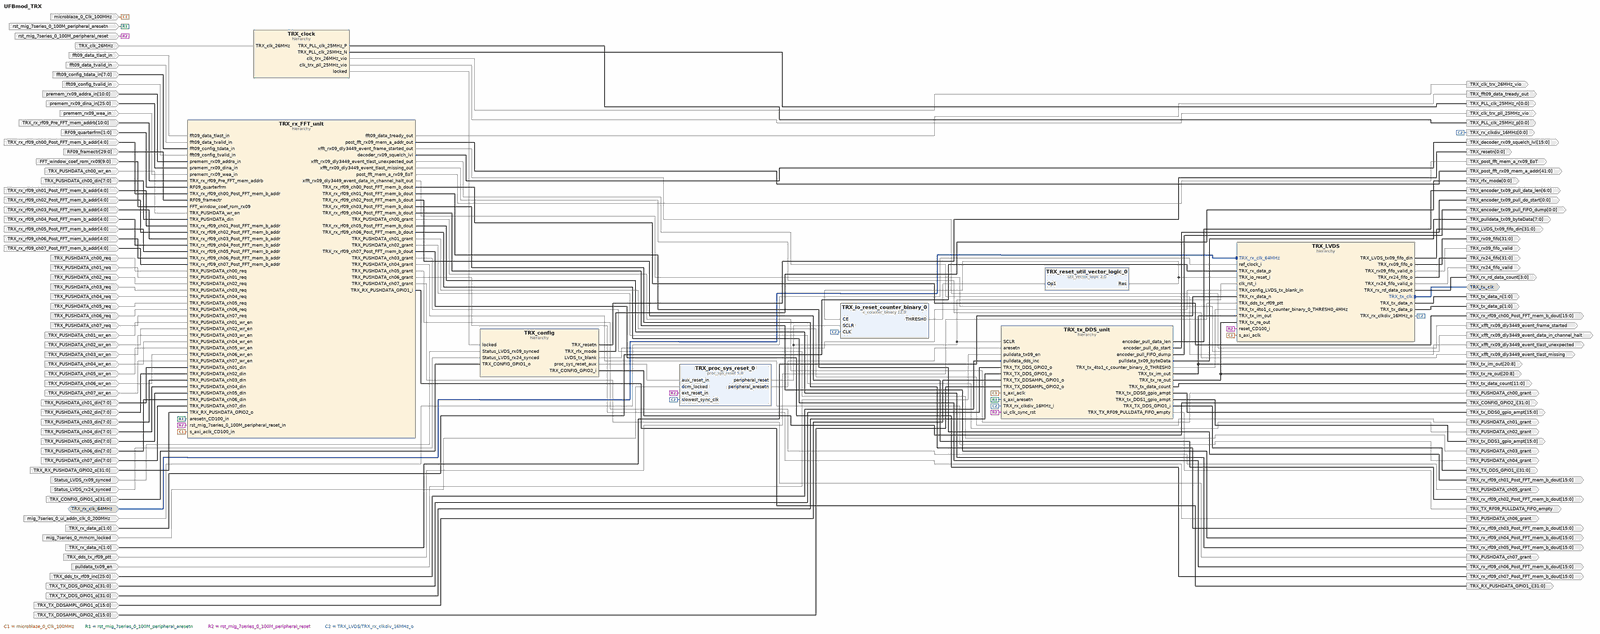
[diagram p0: block diagram of the top level, whole]
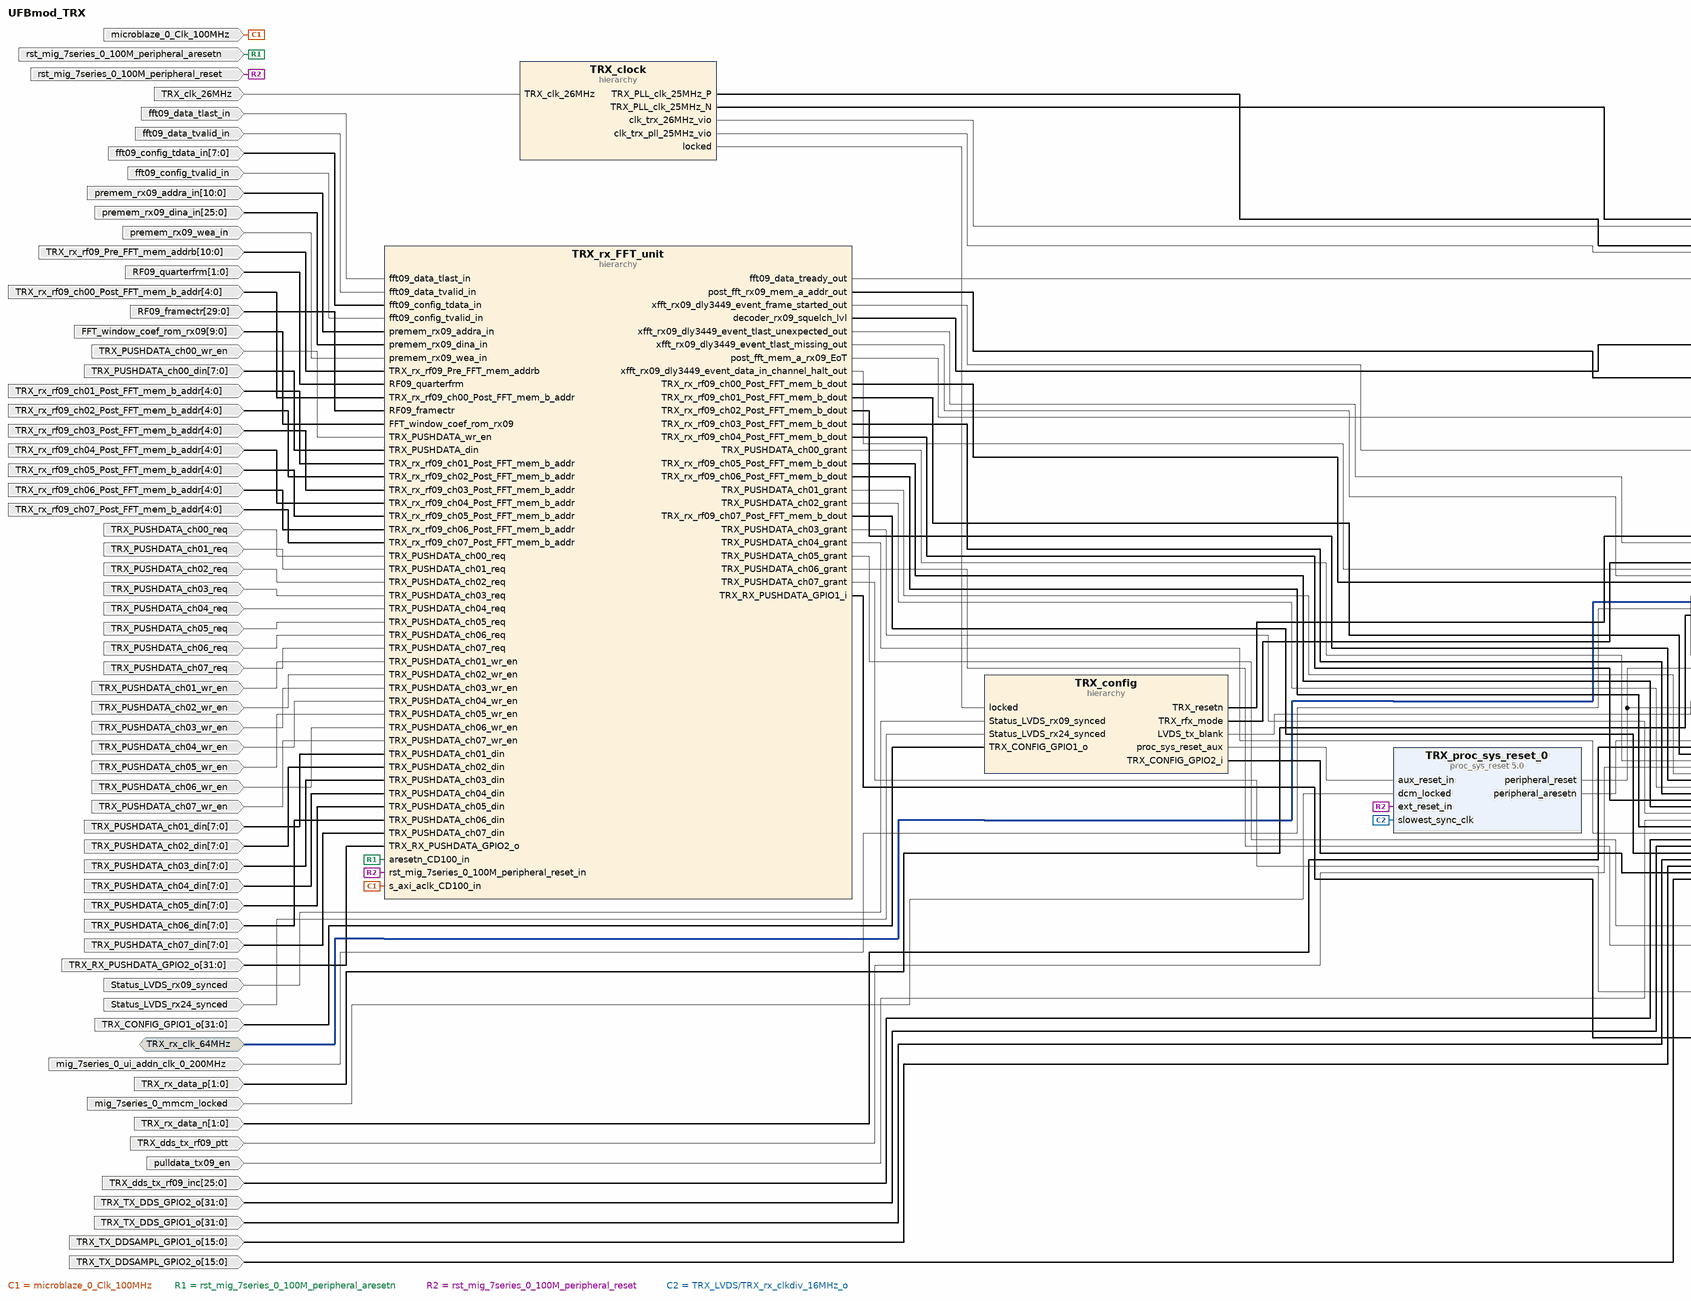
[diagram p1: block diagram of the top level, left part]
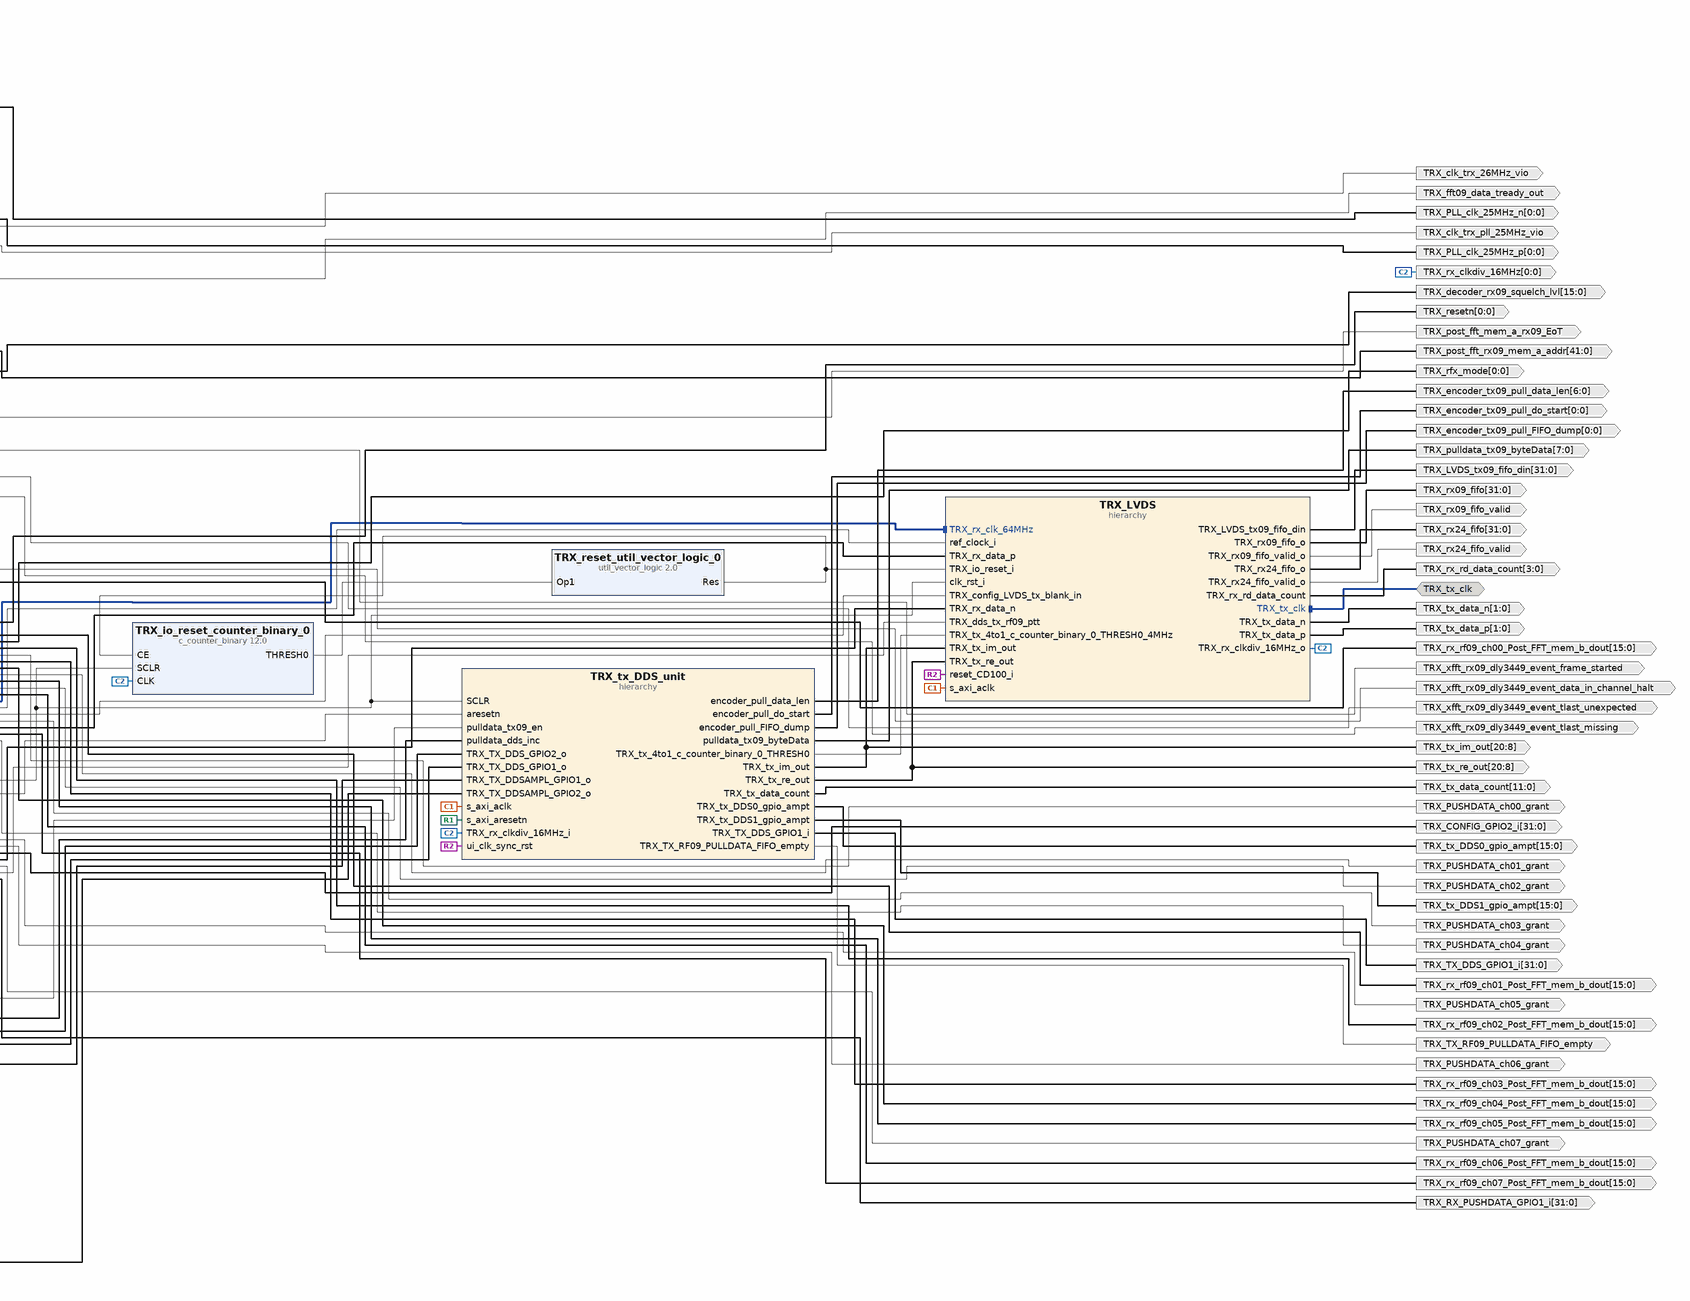
[diagram p2: block diagram of the top level, right part]
# Vivado block design UFBmod_TRX, xc7a100tfgg484-2, Vivado 2020.2
create_bd_design UFBmod_TRX

create_bd_intf_port -mode Slave -vlnv xilinx.com:interface:diff_clock_rtl:1.0 TRX_rx_clk_64MHz
set_property -dict {CONFIG.FREQ_HZ 64000000} [get_bd_intf_ports TRX_rx_clk_64MHz]
create_bd_intf_port -mode Master -vlnv xilinx.com:interface:diff_clock_rtl:1.0 TRX_tx_clk
create_bd_port -dir I -type clk microblaze_0_Clk_100MHz
set_property -dict [list \
  CONFIG.CLK_DOMAIN msys_mig_7series_0_0_ui_clk \
  CONFIG.FREQ_HZ 100000000 \
  CONFIG.PHASE 0 \
] [get_bd_ports microblaze_0_Clk_100MHz]
create_bd_port -dir I -type rst rst_mig_7series_0_100M_peripheral_aresetn
create_bd_port -dir I -type clk TRX_clk_26MHz
set_property -dict {CONFIG.CLK_DOMAIN msys_TRX_clk_26MHz CONFIG.FREQ_HZ 26000000} [get_bd_ports TRX_clk_26MHz]
create_bd_port -dir I -type clk mig_7series_0_ui_addn_clk_0_200MHz
set_property -dict {CONFIG.FREQ_HZ 200000000} [get_bd_ports mig_7series_0_ui_addn_clk_0_200MHz]
create_bd_port -dir I mig_7series_0_mmcm_locked
create_bd_port -dir I -type rst rst_mig_7series_0_100M_peripheral_reset
set_property -dict {CONFIG.POLARITY ACTIVE_HIGH} [get_bd_ports rst_mig_7series_0_100M_peripheral_reset]
create_bd_port -dir I -from 1 -to 0 TRX_rx_data_p
create_bd_port -dir I -from 1 -to 0 TRX_rx_data_n
create_bd_port -dir I fft09_data_tlast_in
create_bd_port -dir I fft09_data_tvalid_in
create_bd_port -dir I -from 7 -to 0 -type data fft09_config_tdata_in
create_bd_port -dir I fft09_config_tvalid_in
create_bd_port -dir I -from 10 -to 0 -type data premem_rx09_addra_in
create_bd_port -dir I -from 25 -to 0 -type data premem_rx09_dina_in
create_bd_port -dir I premem_rx09_wea_in
create_bd_port -dir I -from 10 -to 0 -type data TRX_rx_rf09_Pre_FFT_mem_addrb
create_bd_port -dir I -from 1 -to 0 -type data RF09_quarterfrm
create_bd_port -dir I -from 4 -to 0 -type data TRX_rx_rf09_ch00_Post_FFT_mem_b_addr
create_bd_port -dir I TRX_dds_tx_rf09_ptt
create_bd_port -dir I Status_LVDS_rx09_synced
create_bd_port -dir I Status_LVDS_rx24_synced
create_bd_port -dir I -from 29 -to 0 -type data RF09_framectr
create_bd_port -dir I -from 9 -to 0 -type data FFT_window_coef_rom_rx09
create_bd_port -dir I pulldata_tx09_en
create_bd_port -dir I -from 25 -to 0 -type data TRX_dds_tx_rf09_inc
create_bd_port -dir O -from 0 -to 0 -type rst TRX_resetn
create_bd_port -dir O -from 0 -to 0 TRX_rfx_mode
create_bd_port -dir O -from 0 -to 0 -type clk TRX_PLL_clk_25MHz_p
create_bd_port -dir O -from 0 -to 0 -type clk TRX_PLL_clk_25MHz_n
create_bd_port -dir O -from 0 -to 0 -type clk TRX_rx_clkdiv_16MHz
create_bd_port -dir O -from 1 -to 0 TRX_tx_data_p
create_bd_port -dir O -from 1 -to 0 TRX_tx_data_n
create_bd_port -dir O -from 3 -to 0 -type data TRX_rx_rd_data_count
create_bd_port -dir O -from 31 -to 0 -type data TRX_rx09_fifo
create_bd_port -dir O -from 31 -to 0 -type data TRX_rx24_fifo
create_bd_port -dir O TRX_rx09_fifo_valid
create_bd_port -dir O TRX_rx24_fifo_valid
create_bd_port -dir O TRX_fft09_data_tready_out
create_bd_port -dir O TRX_xfft_rx09_dly3449_event_frame_started
create_bd_port -dir O TRX_xfft_rx09_dly3449_event_tlast_unexpected
create_bd_port -dir O TRX_xfft_rx09_dly3449_event_tlast_missing
create_bd_port -dir O TRX_xfft_rx09_dly3449_event_data_in_channel_halt
create_bd_port -dir O -from 15 -to 0 TRX_rx_rf09_ch00_Post_FFT_mem_b_dout
create_bd_port -dir O -type clk TRX_clk_trx_26MHz_vio
create_bd_port -dir O -type clk TRX_clk_trx_pll_25MHz_vio
create_bd_port -dir O -from 20 -to 8 -type data TRX_tx_re_out
create_bd_port -dir O -from 20 -to 8 -type data TRX_tx_im_out
create_bd_port -dir O -from 41 -to 0 -type data TRX_post_fft_rx09_mem_a_addr
create_bd_port -dir O TRX_post_fft_mem_a_rx09_EoT
create_bd_port -dir O -from 6 -to 0 -type data TRX_encoder_tx09_pull_data_len
create_bd_port -dir O -from 7 -to 0 -type data TRX_pulldata_tx09_byteData
create_bd_port -dir O -from 0 -to 0 TRX_encoder_tx09_pull_do_start
create_bd_port -dir O -from 0 -to 0 TRX_encoder_tx09_pull_FIFO_dump
create_bd_port -dir O -from 11 -to 0 -type data TRX_tx_data_count
create_bd_port -dir O TRX_TX_RF09_PULLDATA_FIFO_empty
create_bd_port -dir O -from 15 -to 0 -type data TRX_decoder_rx09_squelch_lvl
create_bd_port -dir O -from 15 -to 0 -type data TRX_tx_DDS0_gpio_ampt
create_bd_port -dir O -from 15 -to 0 -type data TRX_tx_DDS1_gpio_ampt
create_bd_port -dir I TRX_PUSHDATA_ch00_wr_en
create_bd_port -dir I -from 7 -to 0 -type data TRX_PUSHDATA_ch00_din
create_bd_port -dir I -from 4 -to 0 -type data TRX_rx_rf09_ch01_Post_FFT_mem_b_addr
create_bd_port -dir I -from 4 -to 0 -type data TRX_rx_rf09_ch02_Post_FFT_mem_b_addr
create_bd_port -dir I -from 4 -to 0 -type data TRX_rx_rf09_ch03_Post_FFT_mem_b_addr
create_bd_port -dir I -from 4 -to 0 -type data TRX_rx_rf09_ch04_Post_FFT_mem_b_addr
create_bd_port -dir I -from 4 -to 0 -type data TRX_rx_rf09_ch05_Post_FFT_mem_b_addr
create_bd_port -dir I -from 4 -to 0 -type data TRX_rx_rf09_ch06_Post_FFT_mem_b_addr
create_bd_port -dir I -from 4 -to 0 -type data TRX_rx_rf09_ch07_Post_FFT_mem_b_addr
create_bd_port -dir O -from 15 -to 0 -type data TRX_rx_rf09_ch01_Post_FFT_mem_b_dout
create_bd_port -dir O -from 15 -to 0 -type data TRX_rx_rf09_ch02_Post_FFT_mem_b_dout
create_bd_port -dir O -from 15 -to 0 -type data TRX_rx_rf09_ch06_Post_FFT_mem_b_dout
create_bd_port -dir O -from 15 -to 0 -type data TRX_rx_rf09_ch07_Post_FFT_mem_b_dout
create_bd_port -dir O -from 15 -to 0 -type data TRX_rx_rf09_ch03_Post_FFT_mem_b_dout
create_bd_port -dir O -from 15 -to 0 -type data TRX_rx_rf09_ch04_Post_FFT_mem_b_dout
create_bd_port -dir O -from 15 -to 0 -type data TRX_rx_rf09_ch05_Post_FFT_mem_b_dout
create_bd_port -dir I TRX_PUSHDATA_ch01_wr_en
create_bd_port -dir I -from 7 -to 0 -type data TRX_PUSHDATA_ch01_din
create_bd_port -dir I TRX_PUSHDATA_ch00_req
create_bd_port -dir I TRX_PUSHDATA_ch01_req
create_bd_port -dir O TRX_PUSHDATA_ch00_grant
create_bd_port -dir O TRX_PUSHDATA_ch01_grant
create_bd_port -dir O TRX_PUSHDATA_ch02_grant
create_bd_port -dir O TRX_PUSHDATA_ch03_grant
create_bd_port -dir O TRX_PUSHDATA_ch04_grant
create_bd_port -dir O TRX_PUSHDATA_ch05_grant
create_bd_port -dir O TRX_PUSHDATA_ch06_grant
create_bd_port -dir O TRX_PUSHDATA_ch07_grant
create_bd_port -dir I TRX_PUSHDATA_ch02_req
create_bd_port -dir I TRX_PUSHDATA_ch03_req
create_bd_port -dir I TRX_PUSHDATA_ch04_req
create_bd_port -dir I TRX_PUSHDATA_ch05_req
create_bd_port -dir I TRX_PUSHDATA_ch06_req
create_bd_port -dir I TRX_PUSHDATA_ch07_req
create_bd_port -dir I TRX_PUSHDATA_ch02_wr_en
create_bd_port -dir I TRX_PUSHDATA_ch03_wr_en
create_bd_port -dir I TRX_PUSHDATA_ch04_wr_en
create_bd_port -dir I TRX_PUSHDATA_ch05_wr_en
create_bd_port -dir I TRX_PUSHDATA_ch06_wr_en
create_bd_port -dir I TRX_PUSHDATA_ch07_wr_en
create_bd_port -dir I -from 7 -to 0 -type data TRX_PUSHDATA_ch02_din
create_bd_port -dir I -from 7 -to 0 -type data TRX_PUSHDATA_ch03_din
create_bd_port -dir I -from 7 -to 0 -type data TRX_PUSHDATA_ch04_din
create_bd_port -dir I -from 7 -to 0 -type data TRX_PUSHDATA_ch05_din
create_bd_port -dir I -from 7 -to 0 -type data TRX_PUSHDATA_ch06_din
create_bd_port -dir I -from 7 -to 0 -type data TRX_PUSHDATA_ch07_din
create_bd_port -dir I -from 31 -to 0 TRX_CONFIG_GPIO1_o
create_bd_port -dir O -from 31 -to 0 TRX_CONFIG_GPIO2_i
create_bd_port -dir I -from 31 -to 0 TRX_TX_DDS_GPIO2_o
create_bd_port -dir O -from 31 -to 0 TRX_TX_DDS_GPIO1_i
create_bd_port -dir I -from 31 -to 0 TRX_TX_DDS_GPIO1_o
create_bd_port -dir I -from 15 -to 0 TRX_TX_DDSAMPL_GPIO1_o
create_bd_port -dir I -from 15 -to 0 TRX_TX_DDSAMPL_GPIO2_o
create_bd_port -dir I -from 31 -to 0 TRX_RX_PUSHDATA_GPIO2_o
create_bd_port -dir O -from 31 -to 0 TRX_RX_PUSHDATA_GPIO1_i
create_bd_port -dir O -from 31 -to 0 -type data TRX_LVDS_tx09_fifo_din

create_bd_cell -type ip -vlnv xilinx.com:ip:proc_sys_reset:5.0 TRX_proc_sys_reset_0
set_property -dict [list \
  CONFIG.C_AUX_RESET_HIGH 1 \
  CONFIG.RESET_BOARD_INTERFACE Custom \
  CONFIG.USE_BOARD_FLOW true \
] [get_bd_cells TRX_proc_sys_reset_0]
create_bd_cell -type ip -vlnv xilinx.com:ip:c_counter_binary:12.0 TRX_io_reset_counter_binary_0
set_property -dict [list \
  CONFIG.CE true \
  CONFIG.Count_Mode UP \
  CONFIG.Final_Count_Value 1e \
  CONFIG.Output_Width 5 \
  CONFIG.Restrict_Count true \
  CONFIG.SCLR true \
  CONFIG.Sync_Threshold_Output true \
  CONFIG.Threshold_Value 1e \
] [get_bd_cells TRX_io_reset_counter_binary_0]
create_bd_cell -type hier TRX_LVDS
create_bd_cell -type hier TRX_rx_FFT_unit
create_bd_cell -type hier TRX_config
create_bd_cell -type hier TRX_clock
create_bd_cell -type hier TRX_tx_DDS_unit
create_bd_cell -type ip -vlnv xilinx.com:ip:util_vector_logic:2.0 TRX_reset_util_vector_logic_0
set_property -dict {CONFIG.C_OPERATION not CONFIG.C_SIZE 1} [get_bd_cells TRX_reset_util_vector_logic_0]

# ---- hierarchy /TRX_LVDS ----
current_bd_instance /TRX_LVDS
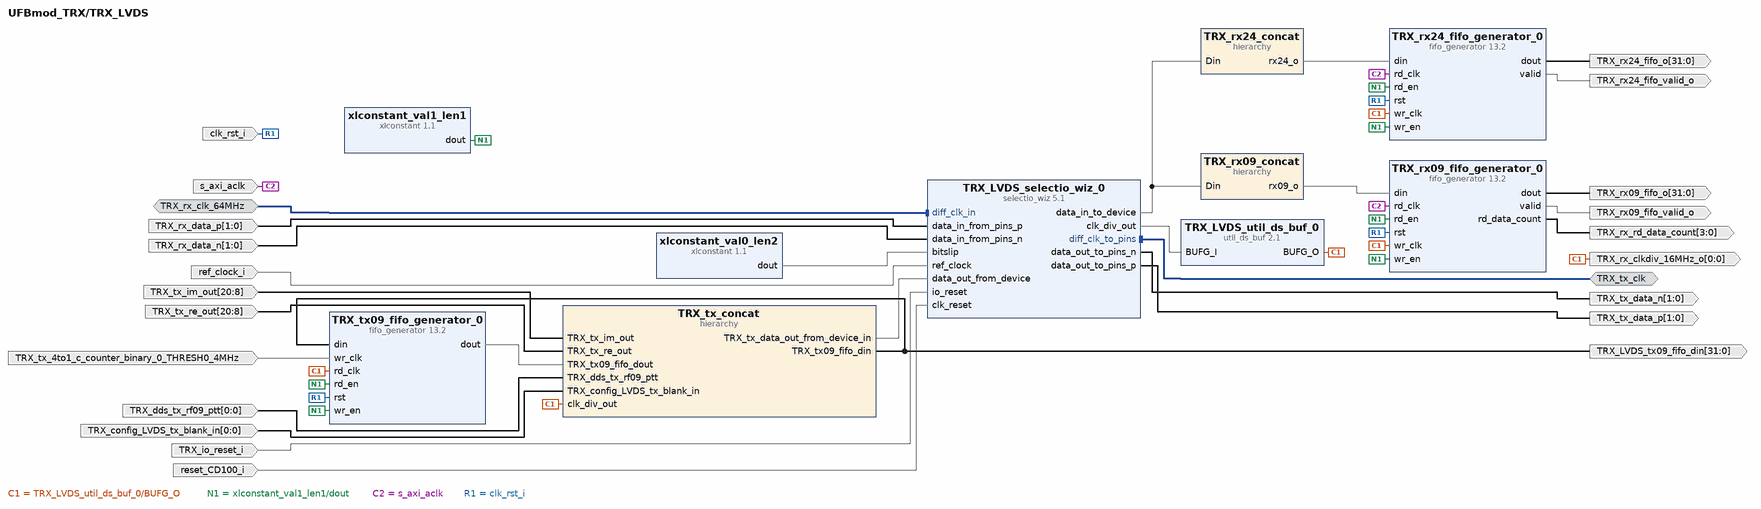
[diagram p3: block diagram inside /TRX_LVDS]
create_bd_intf_pin -mode Slave -vlnv xilinx.com:interface:diff_clock_rtl:1.0 TRX_rx_clk_64MHz
create_bd_intf_pin -mode Master -vlnv xilinx.com:interface:diff_clock_rtl:1.0 TRX_tx_clk
create_bd_pin -dir I -from 1 -to 0 TRX_rx_data_p
create_bd_pin -dir I -from 1 -to 0 TRX_rx_data_n
create_bd_pin -dir O -from 1 -to 0 TRX_tx_data_p
create_bd_pin -dir O -from 1 -to 0 TRX_tx_data_n
create_bd_pin -dir I -type rst TRX_io_reset_i
create_bd_pin -dir I ref_clock_i
create_bd_pin -dir O -from 0 -to 0 -type clk TRX_rx_clkdiv_16MHz_o
create_bd_pin -dir I -type clk s_axi_aclk
create_bd_pin -dir I clk_rst_i
create_bd_pin -dir O -from 3 -to 0 TRX_rx_rd_data_count
create_bd_pin -dir O -from 31 -to 0 TRX_rx09_fifo_o
create_bd_pin -dir O -from 31 -to 0 TRX_rx24_fifo_o
create_bd_pin -dir O TRX_rx09_fifo_valid_o
create_bd_pin -dir O TRX_rx24_fifo_valid_o
create_bd_pin -dir I -from 20 -to 8 -type data TRX_tx_im_out
create_bd_pin -dir I -from 20 -to 8 -type data TRX_tx_re_out
create_bd_pin -dir I -from 0 -to 0 TRX_dds_tx_rf09_ptt
create_bd_pin -dir I -type data TRX_tx_4to1_c_counter_binary_0_THRESH0_4MHz
create_bd_pin -dir I -from 0 -to 0 TRX_config_LVDS_tx_blank_in
create_bd_pin -dir I -type rst reset_CD100_i
create_bd_pin -dir O -from 31 -to 0 TRX_LVDS_tx09_fifo_din

create_bd_cell -type hier TRX_rx09_concat
create_bd_cell -type hier TRX_rx24_concat
create_bd_cell -type ip -vlnv xilinx.com:ip:fifo_generator:13.2 TRX_rx09_fifo_generator_0
set_property -dict [list \
  CONFIG.Almost_Empty_Flag false \
  CONFIG.Enable_Safety_Circuit true \
  CONFIG.Fifo_Implementation Independent_Clocks_Block_RAM \
  CONFIG.Full_Flags_Reset_Value 1 \
  CONFIG.Input_Data_Width 8 \
  CONFIG.Input_Depth 64 \
  CONFIG.Output_Data_Width 32 \
  CONFIG.Output_Register_Type Both \
  CONFIG.Read_Data_Count true \
  CONFIG.Read_Data_Count_Width 4 \
  CONFIG.Underflow_Flag false \
  CONFIG.Use_Dout_Reset true \
  CONFIG.Use_Embedded_Registers true \
  CONFIG.Valid_Flag true \
  CONFIG.Write_Data_Count false \
  CONFIG.synchronization_stages 3 \
] [get_bd_cells TRX_rx09_fifo_generator_0]
create_bd_cell -type ip -vlnv xilinx.com:ip:fifo_generator:13.2 TRX_rx24_fifo_generator_0
set_property -dict [list \
  CONFIG.Almost_Empty_Flag false \
  CONFIG.Enable_Reset_Synchronization true \
  CONFIG.Enable_Safety_Circuit true \
  CONFIG.Fifo_Implementation Independent_Clocks_Block_RAM \
  CONFIG.Full_Flags_Reset_Value 1 \
  CONFIG.Input_Data_Width 8 \
  CONFIG.Input_Depth 64 \
  CONFIG.Output_Data_Width 32 \
  CONFIG.Output_Register_Type Both \
  CONFIG.Read_Data_Count false \
  CONFIG.Reset_Pin true \
  CONFIG.Underflow_Flag false \
  CONFIG.Use_Dout_Reset true \
  CONFIG.Use_Embedded_Registers true \
  CONFIG.Valid_Flag true \
  CONFIG.Write_Data_Count false \
  CONFIG.synchronization_stages 3 \
] [get_bd_cells TRX_rx24_fifo_generator_0]
create_bd_cell -type ip -vlnv xilinx.com:ip:fifo_generator:13.2 TRX_tx09_fifo_generator_0
set_property -dict [list \
  CONFIG.Almost_Empty_Flag false \
  CONFIG.Enable_Safety_Circuit true \
  CONFIG.Fifo_Implementation Independent_Clocks_Block_RAM \
  CONFIG.Full_Flags_Reset_Value 1 \
  CONFIG.Input_Data_Width 32 \
  CONFIG.Input_Depth 16 \
  CONFIG.Output_Data_Width 8 \
  CONFIG.Read_Data_Count true \
  CONFIG.Read_Data_Count_Width 6 \
  CONFIG.Underflow_Flag false \
  CONFIG.Use_Dout_Reset true \
  CONFIG.Use_Embedded_Registers true \
  CONFIG.Valid_Flag true \
  CONFIG.Write_Data_Count true \
  CONFIG.Write_Data_Count_Width 4 \
  CONFIG.synchronization_stages 3 \
] [get_bd_cells TRX_tx09_fifo_generator_0]
create_bd_cell -type hier TRX_tx_concat
create_bd_cell -type ip -vlnv xilinx.com:ip:selectio_wiz:5.1 TRX_LVDS_selectio_wiz_0
set_property -dict [list \
  CONFIG.BUS_DIR SEPARATE \
  CONFIG.BUS_IO_STD LVDS_25 \
  CONFIG.BUS_SIG_TYPE DIFF \
  CONFIG.CLK_DELAY FIXED \
  CONFIG.CLK_FWD true \
  CONFIG.CLK_FWD_IO_STD LVDS_25 \
  CONFIG.CLK_FWD_SIG_TYPE DIFF \
  CONFIG.CLK_TAP 16 \
  CONFIG.IDELAY_HIGH_PERF_MODE false \
  CONFIG.SELIO_ACTIVE_EDGE DDR \
  CONFIG.SELIO_BUS_IN_DELAY FIXED \
  CONFIG.SELIO_BUS_IN_TAP 16 \
  CONFIG.SELIO_CLK_BUF BUFIO \
  CONFIG.SELIO_CLK_IO_STD LVDS_25 \
  CONFIG.SELIO_CLK_SIG_TYPE DIFF \
  CONFIG.SELIO_DDR_ALIGNMENT SAME_EDGE_PIPELINED \
  CONFIG.SELIO_IDDR_RST_TYPE ASYNC \
  CONFIG.SELIO_INTERFACE_TYPE NETWORKING \
  CONFIG.SERIALIZATION_FACTOR 8 \
  CONFIG.SYSTEM_DATA_WIDTH 2 \
  CONFIG.USE_SERIALIZATION true \
] [get_bd_cells TRX_LVDS_selectio_wiz_0]
create_bd_cell -type ip -vlnv xilinx.com:ip:xlconstant:1.1 xlconstant_val1_len1
set_property -dict {CONFIG.CONST_VAL 1 CONFIG.CONST_WIDTH 1} [get_bd_cells xlconstant_val1_len1]
create_bd_cell -type ip -vlnv xilinx.com:ip:xlconstant:1.1 xlconstant_val0_len2
set_property -dict {CONFIG.CONST_VAL 0 CONFIG.CONST_WIDTH 2} [get_bd_cells xlconstant_val0_len2]
create_bd_cell -type ip -vlnv xilinx.com:ip:util_ds_buf:2.1 TRX_LVDS_util_ds_buf_0
set_property -dict {CONFIG.C_BUF_TYPE BUFG} [get_bd_cells TRX_LVDS_util_ds_buf_0]

# ---- hierarchy /TRX_LVDS/TRX_rx09_concat ----
current_bd_instance /TRX_LVDS/TRX_rx09_concat
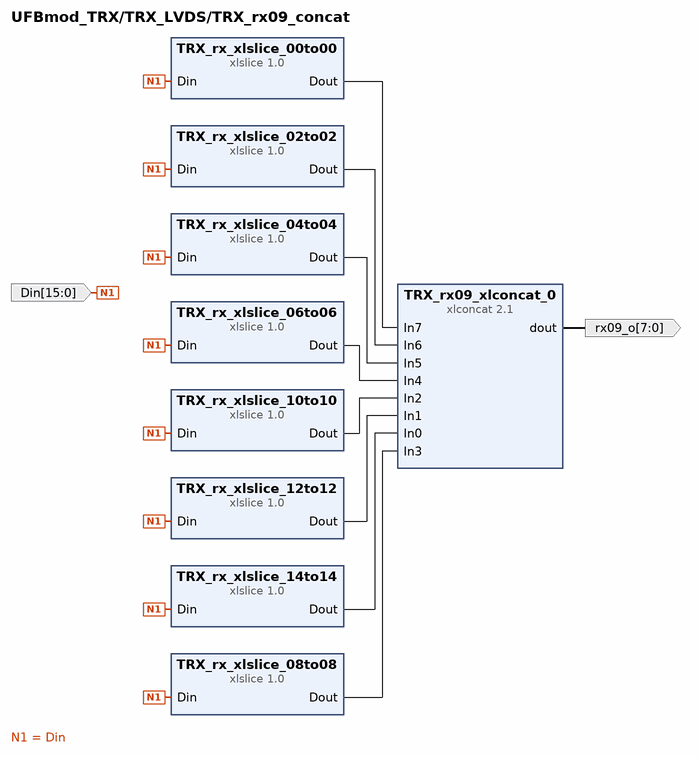
[diagram p4: block diagram inside /TRX_LVDS/TRX_rx09_concat]
create_bd_pin -dir O -from 7 -to 0 rx09_o
create_bd_pin -dir I -from 15 -to 0 Din

create_bd_cell -type ip -vlnv xilinx.com:ip:xlslice:1.0 TRX_rx_xlslice_00to00
set_property -dict [list \
  CONFIG.DIN_FROM 0 \
  CONFIG.DIN_TO 0 \
  CONFIG.DIN_WIDTH 16 \
  CONFIG.DOUT_WIDTH 1 \
] [get_bd_cells TRX_rx_xlslice_00to00]
create_bd_cell -type ip -vlnv xilinx.com:ip:xlslice:1.0 TRX_rx_xlslice_02to02
set_property -dict [list \
  CONFIG.DIN_FROM 2 \
  CONFIG.DIN_TO 2 \
  CONFIG.DIN_WIDTH 16 \
  CONFIG.DOUT_WIDTH 1 \
] [get_bd_cells TRX_rx_xlslice_02to02]
create_bd_cell -type ip -vlnv xilinx.com:ip:xlslice:1.0 TRX_rx_xlslice_04to04
set_property -dict [list \
  CONFIG.DIN_FROM 4 \
  CONFIG.DIN_TO 4 \
  CONFIG.DIN_WIDTH 16 \
  CONFIG.DOUT_WIDTH 1 \
] [get_bd_cells TRX_rx_xlslice_04to04]
create_bd_cell -type ip -vlnv xilinx.com:ip:xlslice:1.0 TRX_rx_xlslice_06to06
set_property -dict [list \
  CONFIG.DIN_FROM 6 \
  CONFIG.DIN_TO 6 \
  CONFIG.DIN_WIDTH 16 \
  CONFIG.DOUT_WIDTH 1 \
] [get_bd_cells TRX_rx_xlslice_06to06]
create_bd_cell -type ip -vlnv xilinx.com:ip:xlslice:1.0 TRX_rx_xlslice_10to10
set_property -dict [list \
  CONFIG.DIN_FROM 10 \
  CONFIG.DIN_TO 10 \
  CONFIG.DIN_WIDTH 16 \
  CONFIG.DOUT_WIDTH 1 \
] [get_bd_cells TRX_rx_xlslice_10to10]
create_bd_cell -type ip -vlnv xilinx.com:ip:xlslice:1.0 TRX_rx_xlslice_12to12
set_property -dict [list \
  CONFIG.DIN_FROM 12 \
  CONFIG.DIN_TO 12 \
  CONFIG.DIN_WIDTH 16 \
  CONFIG.DOUT_WIDTH 1 \
] [get_bd_cells TRX_rx_xlslice_12to12]
create_bd_cell -type ip -vlnv xilinx.com:ip:xlslice:1.0 TRX_rx_xlslice_14to14
set_property -dict [list \
  CONFIG.DIN_FROM 14 \
  CONFIG.DIN_TO 14 \
  CONFIG.DIN_WIDTH 16 \
  CONFIG.DOUT_WIDTH 1 \
] [get_bd_cells TRX_rx_xlslice_14to14]
create_bd_cell -type ip -vlnv xilinx.com:ip:xlslice:1.0 TRX_rx_xlslice_08to08
set_property -dict [list \
  CONFIG.DIN_FROM 8 \
  CONFIG.DIN_TO 8 \
  CONFIG.DIN_WIDTH 16 \
  CONFIG.DOUT_WIDTH 1 \
] [get_bd_cells TRX_rx_xlslice_08to08]
create_bd_cell -type ip -vlnv xilinx.com:ip:xlconcat:2.1 TRX_rx09_xlconcat_0
set_property -dict {CONFIG.NUM_PORTS 8 CONFIG.dout_width 8} [get_bd_cells TRX_rx09_xlconcat_0]

# ---- hierarchy /TRX_LVDS/TRX_rx24_concat ----
current_bd_instance /TRX_LVDS/TRX_rx24_concat
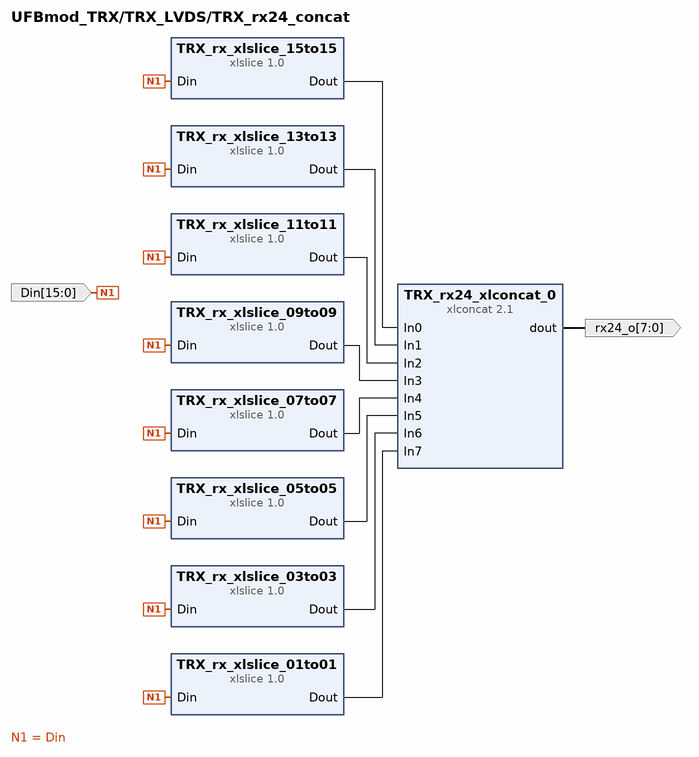
[diagram p5: block diagram inside /TRX_LVDS/TRX_rx24_concat]
create_bd_pin -dir O -from 7 -to 0 rx24_o
create_bd_pin -dir I -from 15 -to 0 Din

create_bd_cell -type ip -vlnv xilinx.com:ip:xlslice:1.0 TRX_rx_xlslice_15to15
set_property -dict [list \
  CONFIG.DIN_FROM 15 \
  CONFIG.DIN_TO 15 \
  CONFIG.DIN_WIDTH 16 \
  CONFIG.DOUT_WIDTH 1 \
] [get_bd_cells TRX_rx_xlslice_15to15]
create_bd_cell -type ip -vlnv xilinx.com:ip:xlslice:1.0 TRX_rx_xlslice_13to13
set_property -dict [list \
  CONFIG.DIN_FROM 13 \
  CONFIG.DIN_TO 13 \
  CONFIG.DIN_WIDTH 16 \
  CONFIG.DOUT_WIDTH 1 \
] [get_bd_cells TRX_rx_xlslice_13to13]
create_bd_cell -type ip -vlnv xilinx.com:ip:xlslice:1.0 TRX_rx_xlslice_11to11
set_property -dict [list \
  CONFIG.DIN_FROM 11 \
  CONFIG.DIN_TO 11 \
  CONFIG.DIN_WIDTH 16 \
  CONFIG.DOUT_WIDTH 1 \
] [get_bd_cells TRX_rx_xlslice_11to11]
create_bd_cell -type ip -vlnv xilinx.com:ip:xlslice:1.0 TRX_rx_xlslice_09to09
set_property -dict [list \
  CONFIG.DIN_FROM 9 \
  CONFIG.DIN_TO 9 \
  CONFIG.DIN_WIDTH 16 \
  CONFIG.DOUT_WIDTH 1 \
] [get_bd_cells TRX_rx_xlslice_09to09]
create_bd_cell -type ip -vlnv xilinx.com:ip:xlslice:1.0 TRX_rx_xlslice_07to07
set_property -dict [list \
  CONFIG.DIN_FROM 7 \
  CONFIG.DIN_TO 7 \
  CONFIG.DIN_WIDTH 16 \
  CONFIG.DOUT_WIDTH 1 \
] [get_bd_cells TRX_rx_xlslice_07to07]
create_bd_cell -type ip -vlnv xilinx.com:ip:xlslice:1.0 TRX_rx_xlslice_05to05
set_property -dict [list \
  CONFIG.DIN_FROM 5 \
  CONFIG.DIN_TO 5 \
  CONFIG.DIN_WIDTH 16 \
  CONFIG.DOUT_WIDTH 1 \
] [get_bd_cells TRX_rx_xlslice_05to05]
create_bd_cell -type ip -vlnv xilinx.com:ip:xlslice:1.0 TRX_rx_xlslice_03to03
set_property -dict [list \
  CONFIG.DIN_FROM 3 \
  CONFIG.DIN_TO 3 \
  CONFIG.DIN_WIDTH 16 \
  CONFIG.DOUT_WIDTH 1 \
] [get_bd_cells TRX_rx_xlslice_03to03]
create_bd_cell -type ip -vlnv xilinx.com:ip:xlslice:1.0 TRX_rx_xlslice_01to01
set_property -dict [list \
  CONFIG.DIN_FROM 1 \
  CONFIG.DIN_TO 1 \
  CONFIG.DIN_WIDTH 16 \
  CONFIG.DOUT_WIDTH 1 \
] [get_bd_cells TRX_rx_xlslice_01to01]
create_bd_cell -type ip -vlnv xilinx.com:ip:xlconcat:2.1 TRX_rx24_xlconcat_0
set_property -dict {CONFIG.NUM_PORTS 8 CONFIG.dout_width 8} [get_bd_cells TRX_rx24_xlconcat_0]

# ---- hierarchy /TRX_LVDS/TRX_tx_concat ----
current_bd_instance /TRX_LVDS/TRX_tx_concat
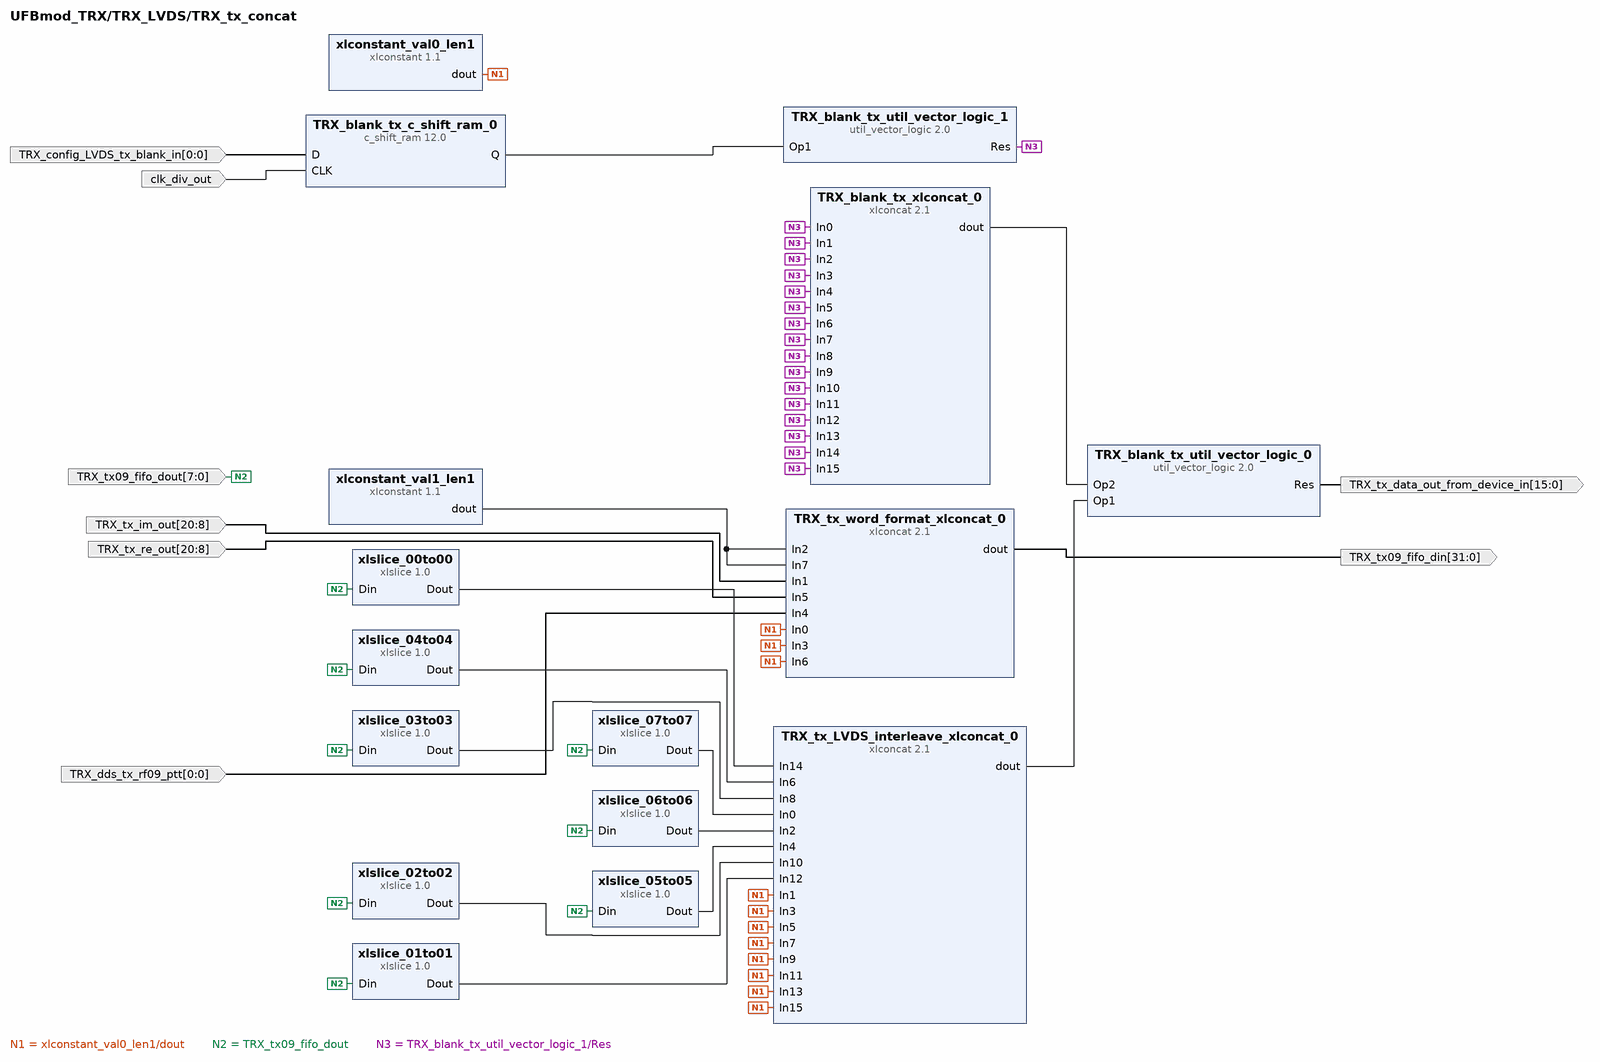
[diagram p6: block diagram inside /TRX_LVDS/TRX_tx_concat]
create_bd_pin -dir O -from 15 -to 0 TRX_tx_data_out_from_device_in
create_bd_pin -dir I -from 7 -to 0 TRX_tx09_fifo_dout
create_bd_pin -dir I -from 20 -to 8 TRX_tx_im_out
create_bd_pin -dir I -from 20 -to 8 TRX_tx_re_out
create_bd_pin -dir I -from 0 -to 0 TRX_dds_tx_rf09_ptt
create_bd_pin -dir O -from 31 -to 0 TRX_tx09_fifo_din
create_bd_pin -dir I -from 0 -to 0 TRX_config_LVDS_tx_blank_in
create_bd_pin -dir I -type clk clk_div_out

create_bd_cell -type ip -vlnv xilinx.com:ip:xlslice:1.0 xlslice_00to00
set_property -dict {CONFIG.DIN_WIDTH 8} [get_bd_cells xlslice_00to00]
create_bd_cell -type ip -vlnv xilinx.com:ip:xlslice:1.0 xlslice_01to01
set_property -dict {CONFIG.DIN_FROM 1 CONFIG.DIN_TO 1 CONFIG.DIN_WIDTH 8 CONFIG.DOUT_WIDTH 1} [get_bd_cells xlslice_01to01]
create_bd_cell -type ip -vlnv xilinx.com:ip:xlslice:1.0 xlslice_02to02
set_property -dict {CONFIG.DIN_FROM 2 CONFIG.DIN_TO 2 CONFIG.DIN_WIDTH 8 CONFIG.DOUT_WIDTH 1} [get_bd_cells xlslice_02to02]
create_bd_cell -type ip -vlnv xilinx.com:ip:xlslice:1.0 xlslice_03to03
set_property -dict {CONFIG.DIN_FROM 3 CONFIG.DIN_TO 3 CONFIG.DIN_WIDTH 8 CONFIG.DOUT_WIDTH 1} [get_bd_cells xlslice_03to03]
create_bd_cell -type ip -vlnv xilinx.com:ip:xlslice:1.0 xlslice_04to04
set_property -dict {CONFIG.DIN_FROM 4 CONFIG.DIN_TO 4 CONFIG.DIN_WIDTH 8 CONFIG.DOUT_WIDTH 1} [get_bd_cells xlslice_04to04]
create_bd_cell -type ip -vlnv xilinx.com:ip:xlslice:1.0 xlslice_05to05
set_property -dict {CONFIG.DIN_FROM 5 CONFIG.DIN_TO 5 CONFIG.DIN_WIDTH 8 CONFIG.DOUT_WIDTH 1} [get_bd_cells xlslice_05to05]
create_bd_cell -type ip -vlnv xilinx.com:ip:xlslice:1.0 xlslice_06to06
set_property -dict {CONFIG.DIN_FROM 6 CONFIG.DIN_TO 6 CONFIG.DIN_WIDTH 8 CONFIG.DOUT_WIDTH 1} [get_bd_cells xlslice_06to06]
create_bd_cell -type ip -vlnv xilinx.com:ip:xlslice:1.0 xlslice_07to07
set_property -dict {CONFIG.DIN_FROM 7 CONFIG.DIN_TO 7 CONFIG.DIN_WIDTH 8 CONFIG.DOUT_WIDTH 1} [get_bd_cells xlslice_07to07]
create_bd_cell -type ip -vlnv xilinx.com:ip:xlconstant:1.1 xlconstant_val0_len1
set_property -dict {CONFIG.CONST_VAL 0} [get_bd_cells xlconstant_val0_len1]
create_bd_cell -type ip -vlnv xilinx.com:ip:xlconstant:1.1 xlconstant_val1_len1
create_bd_cell -type ip -vlnv xilinx.com:ip:c_shift_ram:12.0 TRX_blank_tx_c_shift_ram_0
set_property -dict [list \
  CONFIG.AsyncInitVal 0 \
  CONFIG.DefaultData 0 \
  CONFIG.Depth 2 \
  CONFIG.Width 1 \
] [get_bd_cells TRX_blank_tx_c_shift_ram_0]
create_bd_cell -type ip -vlnv xilinx.com:ip:util_vector_logic:2.0 TRX_blank_tx_util_vector_logic_0
set_property -dict {CONFIG.C_SIZE 16} [get_bd_cells TRX_blank_tx_util_vector_logic_0]
create_bd_cell -type ip -vlnv xilinx.com:ip:util_vector_logic:2.0 TRX_blank_tx_util_vector_logic_1
set_property -dict {CONFIG.C_OPERATION not CONFIG.C_SIZE 1} [get_bd_cells TRX_blank_tx_util_vector_logic_1]
create_bd_cell -type ip -vlnv xilinx.com:ip:xlconcat:2.1 TRX_blank_tx_xlconcat_0
set_property -dict [list \
  CONFIG.IN0_WIDTH 1 \
  CONFIG.IN10_WIDTH 1 \
  CONFIG.IN11_WIDTH 1 \
  CONFIG.IN12_WIDTH 1 \
  CONFIG.IN13_WIDTH 1 \
  CONFIG.IN14_WIDTH 1 \
  CONFIG.IN15_WIDTH 1 \
  CONFIG.IN1_WIDTH 1 \
  CONFIG.IN2_WIDTH 1 \
  CONFIG.IN3_WIDTH 1 \
  CONFIG.IN4_WIDTH 1 \
  CONFIG.IN5_WIDTH 1 \
  CONFIG.IN6_WIDTH 1 \
  CONFIG.IN7_WIDTH 1 \
  CONFIG.IN8_WIDTH 1 \
  CONFIG.IN9_WIDTH 1 \
  CONFIG.NUM_PORTS 16 \
  CONFIG.dout_width 16 \
] [get_bd_cells TRX_blank_tx_xlconcat_0]
create_bd_cell -type ip -vlnv xilinx.com:ip:xlconcat:2.1 TRX_tx_LVDS_interleave_xlconcat_0
set_property -dict {CONFIG.NUM_PORTS 16 CONFIG.dout_width 16} [get_bd_cells TRX_tx_LVDS_interleave_xlconcat_0]
create_bd_cell -type ip -vlnv xilinx.com:ip:xlconcat:2.1 TRX_tx_word_format_xlconcat_0
set_property -dict [list \
  CONFIG.IN0_WIDTH 1 \
  CONFIG.IN1_WIDTH 13 \
  CONFIG.IN2_WIDTH 1 \
  CONFIG.IN3_WIDTH 1 \
  CONFIG.IN4_WIDTH 1 \
  CONFIG.IN5_WIDTH 13 \
  CONFIG.IN6_WIDTH 1 \
  CONFIG.IN7_WIDTH 1 \
  CONFIG.NUM_PORTS 8 \
  CONFIG.dout_width 32 \
] [get_bd_cells TRX_tx_word_format_xlconcat_0]

# ---- hierarchy /TRX_rx_FFT_unit ----
current_bd_instance /TRX_rx_FFT_unit
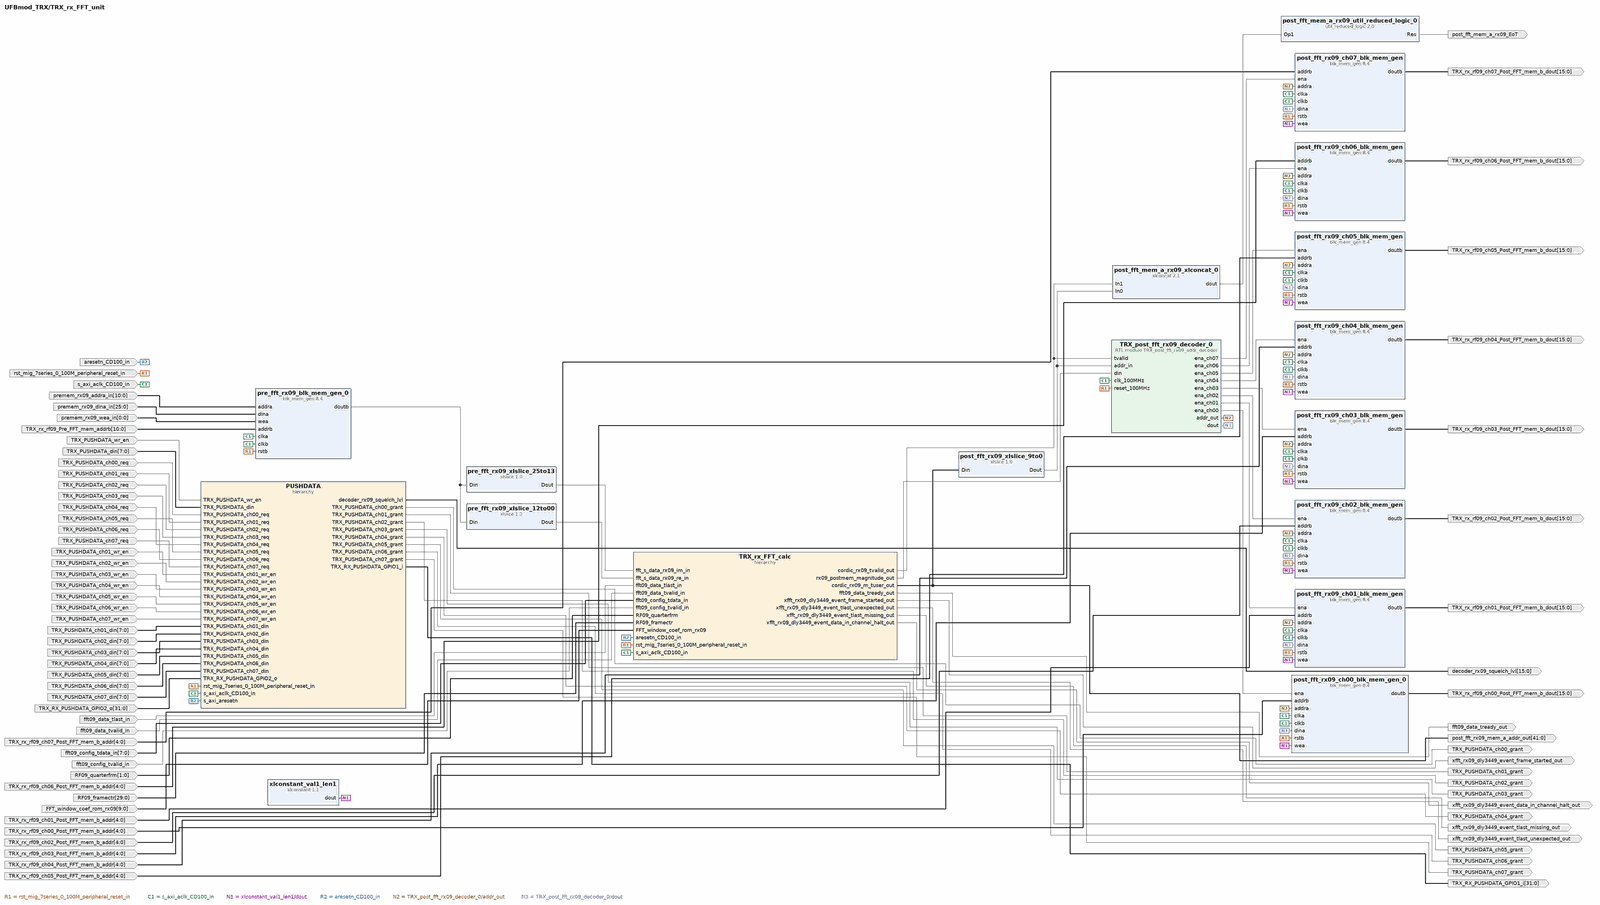
[diagram p7: block diagram inside /TRX_rx_FFT_unit, whole]
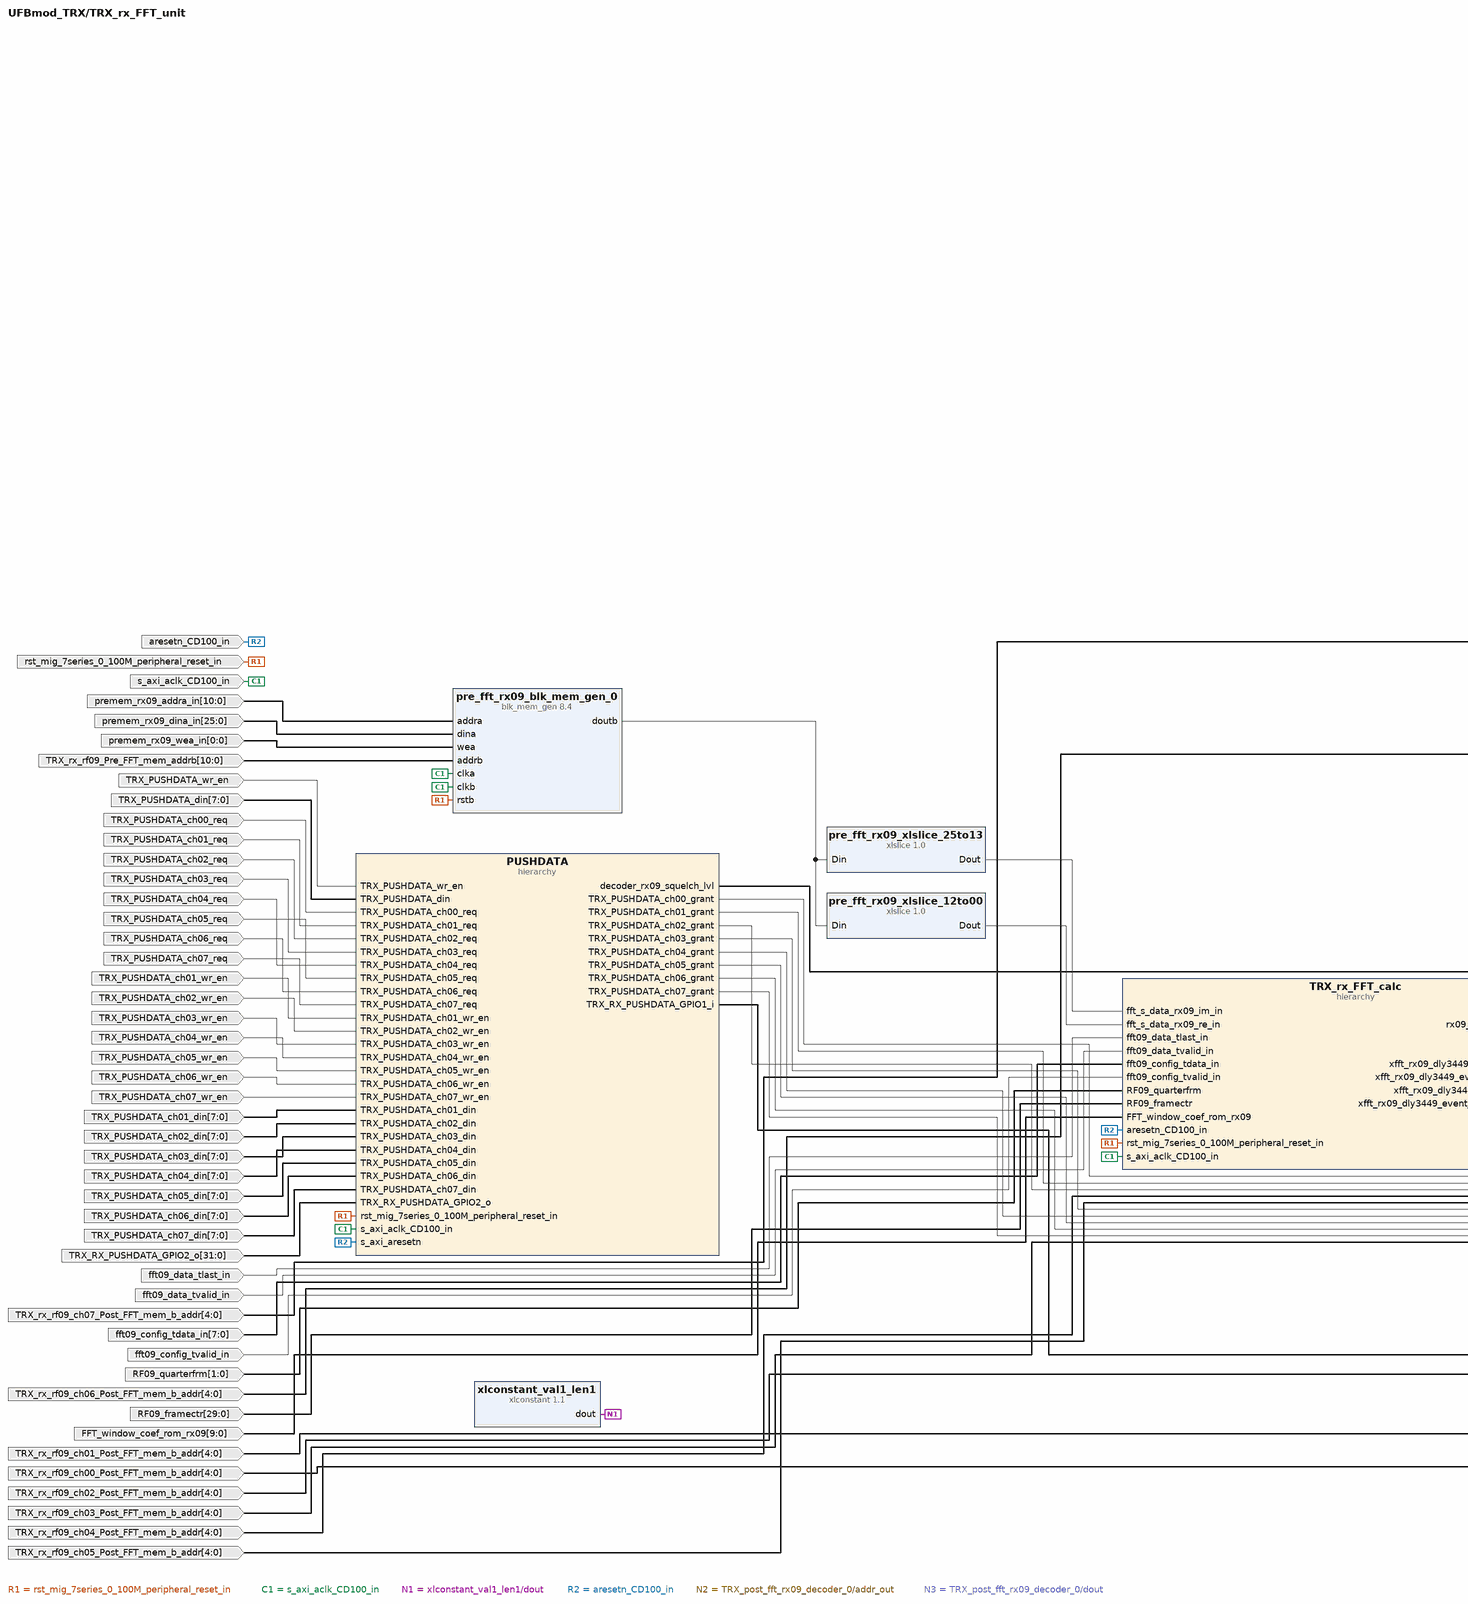
[diagram p8: block diagram inside /TRX_rx_FFT_unit, left part]
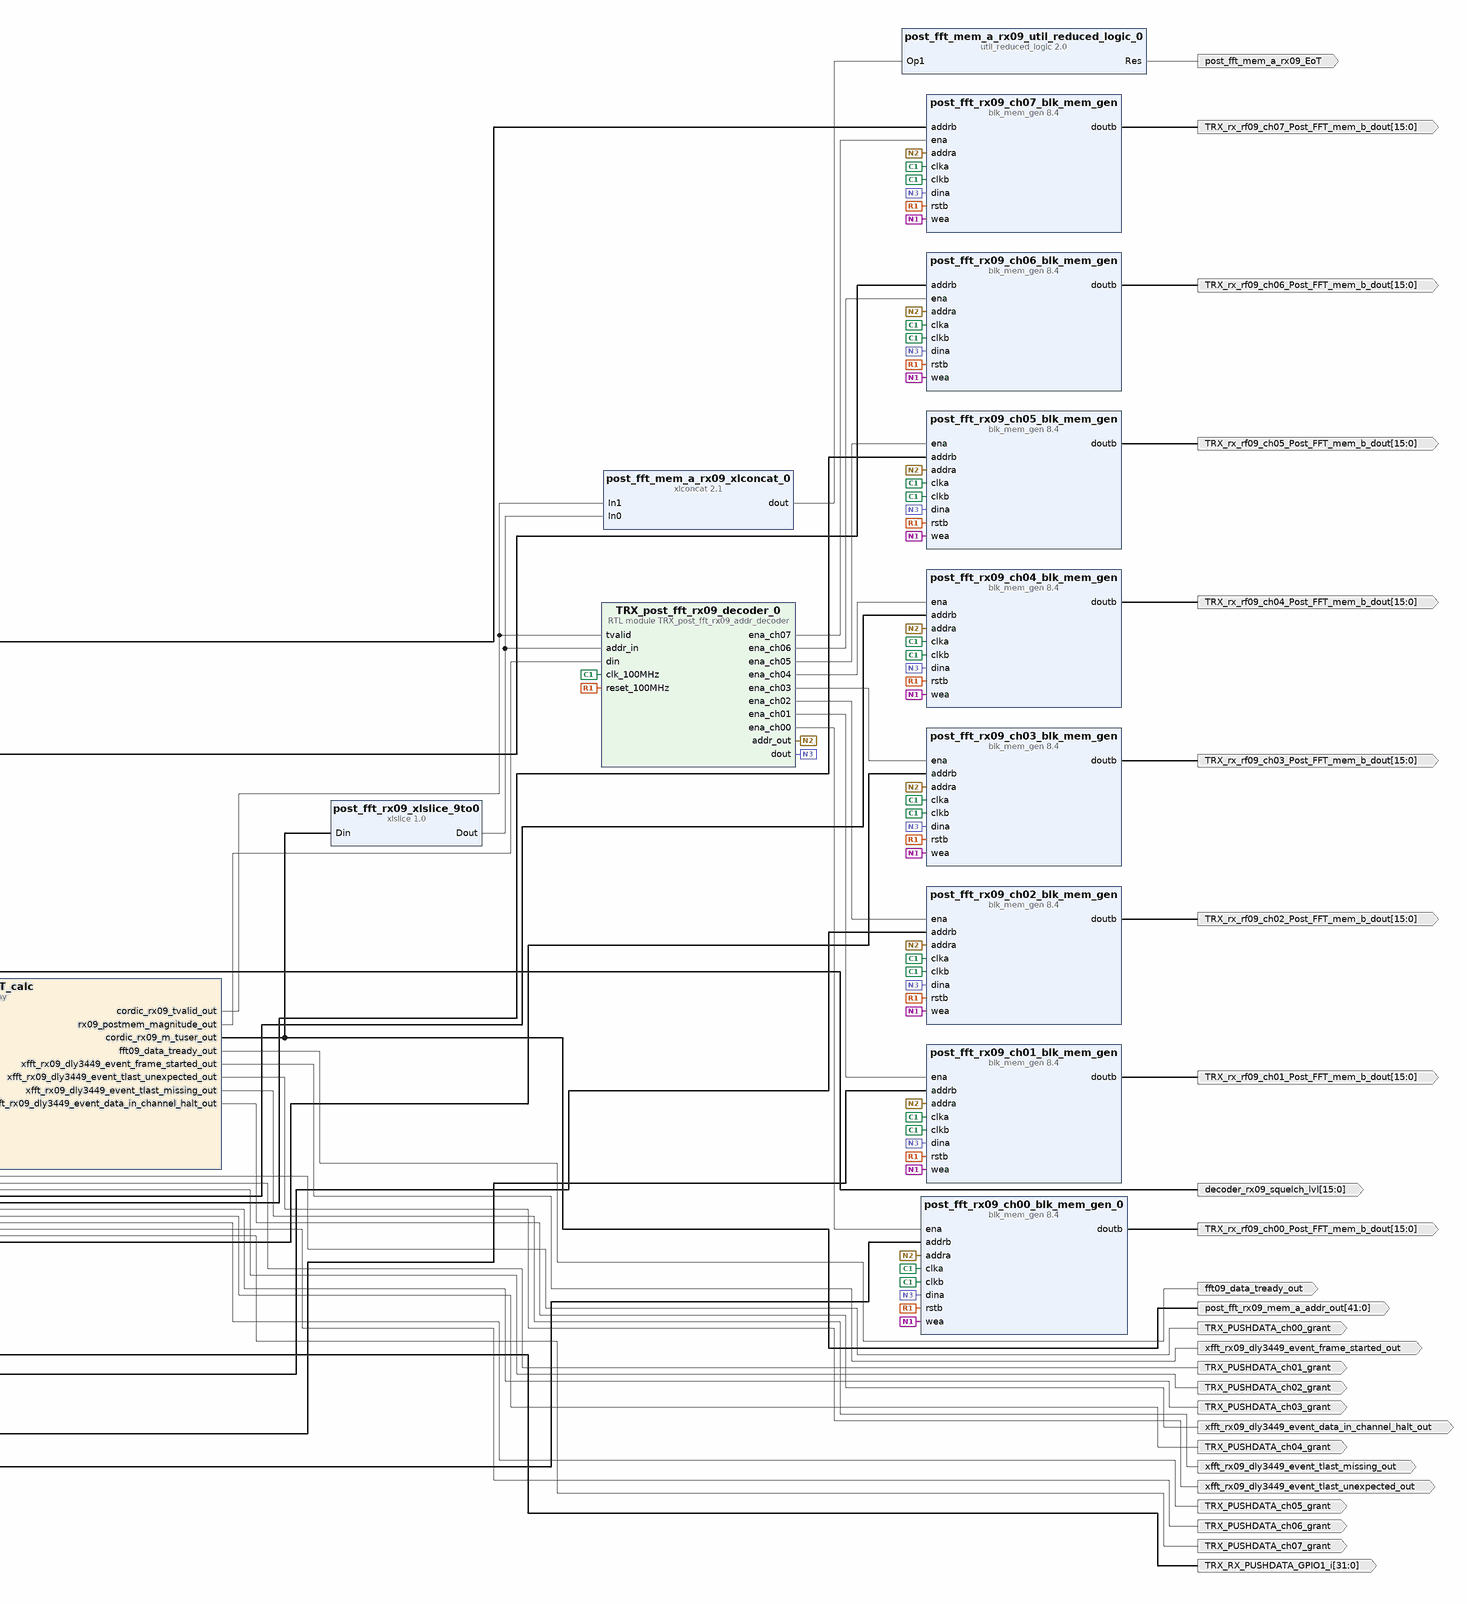
[diagram p9: block diagram inside /TRX_rx_FFT_unit, right part]
create_bd_pin -dir I -type clk s_axi_aclk_CD100_in
create_bd_pin -dir I -type rst aresetn_CD100_in
create_bd_pin -dir I -type rst rst_mig_7series_0_100M_peripheral_reset_in
create_bd_pin -dir I fft09_data_tlast_in
create_bd_pin -dir O fft09_data_tready_out
create_bd_pin -dir I fft09_data_tvalid_in
create_bd_pin -dir I -from 7 -to 0 fft09_config_tdata_in
create_bd_pin -dir I fft09_config_tvalid_in
create_bd_pin -dir O -type intr xfft_rx09_dly3449_event_frame_started_out
create_bd_pin -dir O -type intr xfft_rx09_dly3449_event_tlast_unexpected_out
create_bd_pin -dir O -type intr xfft_rx09_dly3449_event_tlast_missing_out
create_bd_pin -dir O -type intr xfft_rx09_dly3449_event_data_in_channel_halt_out
create_bd_pin -dir I -from 10 -to 0 premem_rx09_addra_in
create_bd_pin -dir I -from 25 -to 0 premem_rx09_dina_in
create_bd_pin -dir I -from 0 -to 0 premem_rx09_wea_in
create_bd_pin -dir I -from 10 -to 0 TRX_rx_rf09_Pre_FFT_mem_addrb
create_bd_pin -dir I -from 4 -to 0 TRX_rx_rf09_ch00_Post_FFT_mem_b_addr
create_bd_pin -dir O -from 15 -to 0 TRX_rx_rf09_ch00_Post_FFT_mem_b_dout
create_bd_pin -dir I -from 1 -to 0 -type data RF09_quarterfrm
create_bd_pin -dir I -from 29 -to 0 RF09_framectr
create_bd_pin -dir I -from 9 -to 0 FFT_window_coef_rom_rx09
create_bd_pin -dir O -from 41 -to 0 post_fft_rx09_mem_a_addr_out
create_bd_pin -dir O post_fft_mem_a_rx09_EoT
create_bd_pin -dir O -from 15 -to 0 decoder_rx09_squelch_lvl
create_bd_pin -dir I TRX_PUSHDATA_wr_en
create_bd_pin -dir I -from 7 -to 0 TRX_PUSHDATA_din
create_bd_pin -dir I -from 4 -to 0 TRX_rx_rf09_ch01_Post_FFT_mem_b_addr
create_bd_pin -dir I -from 4 -to 0 TRX_rx_rf09_ch02_Post_FFT_mem_b_addr
create_bd_pin -dir I -from 4 -to 0 TRX_rx_rf09_ch03_Post_FFT_mem_b_addr
create_bd_pin -dir I -from 4 -to 0 TRX_rx_rf09_ch04_Post_FFT_mem_b_addr
create_bd_pin -dir I -from 4 -to 0 TRX_rx_rf09_ch05_Post_FFT_mem_b_addr
create_bd_pin -dir I -from 4 -to 0 TRX_rx_rf09_ch06_Post_FFT_mem_b_addr
create_bd_pin -dir I -from 4 -to 0 TRX_rx_rf09_ch07_Post_FFT_mem_b_addr
create_bd_pin -dir O -from 15 -to 0 TRX_rx_rf09_ch01_Post_FFT_mem_b_dout
create_bd_pin -dir O -from 15 -to 0 TRX_rx_rf09_ch02_Post_FFT_mem_b_dout
create_bd_pin -dir O -from 15 -to 0 TRX_rx_rf09_ch03_Post_FFT_mem_b_dout
create_bd_pin -dir O -from 15 -to 0 TRX_rx_rf09_ch04_Post_FFT_mem_b_dout
create_bd_pin -dir O -from 15 -to 0 TRX_rx_rf09_ch05_Post_FFT_mem_b_dout
create_bd_pin -dir O -from 15 -to 0 TRX_rx_rf09_ch06_Post_FFT_mem_b_dout
create_bd_pin -dir O -from 15 -to 0 TRX_rx_rf09_ch07_Post_FFT_mem_b_dout
create_bd_pin -dir I TRX_PUSHDATA_ch00_req
create_bd_pin -dir I TRX_PUSHDATA_ch01_req
create_bd_pin -dir I TRX_PUSHDATA_ch02_req
create_bd_pin -dir I TRX_PUSHDATA_ch03_req
create_bd_pin -dir I TRX_PUSHDATA_ch04_req
create_bd_pin -dir I TRX_PUSHDATA_ch05_req
create_bd_pin -dir I TRX_PUSHDATA_ch06_req
create_bd_pin -dir I TRX_PUSHDATA_ch07_req
create_bd_pin -dir O TRX_PUSHDATA_ch00_grant
create_bd_pin -dir O TRX_PUSHDATA_ch01_grant
create_bd_pin -dir O TRX_PUSHDATA_ch02_grant
create_bd_pin -dir O TRX_PUSHDATA_ch03_grant
create_bd_pin -dir O TRX_PUSHDATA_ch04_grant
create_bd_pin -dir O TRX_PUSHDATA_ch05_grant
create_bd_pin -dir O TRX_PUSHDATA_ch06_grant
create_bd_pin -dir O TRX_PUSHDATA_ch07_grant
create_bd_pin -dir I TRX_PUSHDATA_ch01_wr_en
create_bd_pin -dir I TRX_PUSHDATA_ch02_wr_en
create_bd_pin -dir I TRX_PUSHDATA_ch03_wr_en
create_bd_pin -dir I TRX_PUSHDATA_ch04_wr_en
create_bd_pin -dir I TRX_PUSHDATA_ch05_wr_en
create_bd_pin -dir I TRX_PUSHDATA_ch06_wr_en
create_bd_pin -dir I TRX_PUSHDATA_ch07_wr_en
create_bd_pin -dir I -from 7 -to 0 TRX_PUSHDATA_ch01_din
create_bd_pin -dir I -from 7 -to 0 TRX_PUSHDATA_ch02_din
create_bd_pin -dir I -from 7 -to 0 TRX_PUSHDATA_ch03_din
create_bd_pin -dir I -from 7 -to 0 TRX_PUSHDATA_ch04_din
create_bd_pin -dir I -from 7 -to 0 TRX_PUSHDATA_ch05_din
create_bd_pin -dir I -from 7 -to 0 TRX_PUSHDATA_ch06_din
create_bd_pin -dir I -from 7 -to 0 TRX_PUSHDATA_ch07_din
create_bd_pin -dir O -from 31 -to 0 TRX_RX_PUSHDATA_GPIO1_i
create_bd_pin -dir I -from 31 -to 0 TRX_RX_PUSHDATA_GPIO2_o

create_bd_cell -type hier TRX_rx_FFT_calc
create_bd_cell -type ip -vlnv xilinx.com:ip:blk_mem_gen:8.4 pre_fft_rx09_blk_mem_gen_0
set_property -dict [list \
  CONFIG.Assume_Synchronous_Clk true \
  CONFIG.Enable_32bit_Address false \
  CONFIG.Enable_A Always_Enabled \
  CONFIG.Enable_B Always_Enabled \
  CONFIG.Fill_Remaining_Memory_Locations true \
  CONFIG.Memory_Type Simple_Dual_Port_RAM \
  CONFIG.Operating_Mode_A WRITE_FIRST \
  CONFIG.Port_B_Clock 100 \
  CONFIG.Port_B_Enable_Rate 100 \
  CONFIG.Read_Width_B 26 \
  CONFIG.Register_PortB_Output_of_Memory_Core true \
  CONFIG.Register_PortB_Output_of_Memory_Primitives false \
  CONFIG.Use_Byte_Write_Enable false \
  CONFIG.Use_RSTB_Pin true \
  CONFIG.Write_Depth_A 2048 \
  CONFIG.Write_Width_A 26 \
  CONFIG.Write_Width_B 26 \
  CONFIG.use_bram_block Stand_Alone \
] [get_bd_cells pre_fft_rx09_blk_mem_gen_0]
create_bd_cell -type ip -vlnv xilinx.com:ip:blk_mem_gen:8.4 post_fft_rx09_ch00_blk_mem_gen_0
set_property -dict [list \
  CONFIG.Assume_Synchronous_Clk true \
  CONFIG.Enable_32bit_Address false \
  CONFIG.Enable_A Use_ENA_Pin \
  CONFIG.Enable_B Always_Enabled \
  CONFIG.Fill_Remaining_Memory_Locations false \
  CONFIG.Memory_Type Simple_Dual_Port_RAM \
  CONFIG.Operating_Mode_A NO_CHANGE \
  CONFIG.Port_B_Clock 100 \
  CONFIG.Port_B_Enable_Rate 100 \
  CONFIG.Read_Width_B 16 \
  CONFIG.Register_PortB_Output_of_Memory_Core true \
  CONFIG.Register_PortB_Output_of_Memory_Primitives false \
  CONFIG.Use_Byte_Write_Enable false \
  CONFIG.Use_RSTB_Pin true \
  CONFIG.Write_Depth_A 32 \
  CONFIG.Write_Width_A 16 \
  CONFIG.Write_Width_B 16 \
  CONFIG.use_bram_block Stand_Alone \
] [get_bd_cells post_fft_rx09_ch00_blk_mem_gen_0]
create_bd_cell -type ip -vlnv xilinx.com:ip:xlslice:1.0 pre_fft_rx09_xlslice_25to13
set_property -dict [list \
  CONFIG.DIN_FROM 25 \
  CONFIG.DIN_TO 13 \
  CONFIG.DIN_WIDTH 26 \
  CONFIG.DOUT_WIDTH 13 \
] [get_bd_cells pre_fft_rx09_xlslice_25to13]
create_bd_cell -type ip -vlnv xilinx.com:ip:xlslice:1.0 pre_fft_rx09_xlslice_12to00
set_property -dict {CONFIG.DIN_FROM 12 CONFIG.DIN_WIDTH 26 CONFIG.DOUT_WIDTH 13} [get_bd_cells pre_fft_rx09_xlslice_12to00]
create_bd_cell -type ip -vlnv xilinx.com:ip:xlslice:1.0 post_fft_rx09_xlslice_9to0
set_property -dict {CONFIG.DIN_FROM 9 CONFIG.DIN_WIDTH 42 CONFIG.DOUT_WIDTH 10} [get_bd_cells post_fft_rx09_xlslice_9to0]
create_bd_cell -type ip -vlnv xilinx.com:ip:xlconstant:1.1 xlconstant_val1_len1
create_bd_cell -type ip -vlnv xilinx.com:ip:util_reduced_logic:2.0 post_fft_mem_a_rx09_util_reduced_logic_0
set_property -dict {CONFIG.C_SIZE 11} [get_bd_cells post_fft_mem_a_rx09_util_reduced_logic_0]
create_bd_cell -type hier PUSHDATA
create_bd_cell -type ip -vlnv xilinx.com:ip:blk_mem_gen:8.4 post_fft_rx09_ch01_blk_mem_gen
set_property -dict [list \
  CONFIG.Assume_Synchronous_Clk true \
  CONFIG.Enable_32bit_Address false \
  CONFIG.Enable_A Use_ENA_Pin \
  CONFIG.Enable_B Always_Enabled \
  CONFIG.Fill_Remaining_Memory_Locations false \
  CONFIG.Memory_Type Simple_Dual_Port_RAM \
  CONFIG.Operating_Mode_A NO_CHANGE \
  CONFIG.Port_B_Clock 100 \
  CONFIG.Port_B_Enable_Rate 100 \
  CONFIG.Read_Width_B 16 \
  CONFIG.Register_PortB_Output_of_Memory_Core true \
  CONFIG.Register_PortB_Output_of_Memory_Primitives false \
  CONFIG.Use_Byte_Write_Enable false \
  CONFIG.Use_RSTB_Pin true \
  CONFIG.Write_Depth_A 32 \
  CONFIG.Write_Width_A 16 \
  CONFIG.Write_Width_B 16 \
  CONFIG.use_bram_block Stand_Alone \
] [get_bd_cells post_fft_rx09_ch01_blk_mem_gen]
create_bd_cell -type ip -vlnv xilinx.com:ip:blk_mem_gen:8.4 post_fft_rx09_ch02_blk_mem_gen
set_property -dict [list \
  CONFIG.Assume_Synchronous_Clk true \
  CONFIG.Enable_32bit_Address false \
  CONFIG.Enable_A Use_ENA_Pin \
  CONFIG.Enable_B Always_Enabled \
  CONFIG.Fill_Remaining_Memory_Locations false \
  CONFIG.Memory_Type Simple_Dual_Port_RAM \
  CONFIG.Operating_Mode_A NO_CHANGE \
  CONFIG.Port_B_Clock 100 \
  CONFIG.Port_B_Enable_Rate 100 \
  CONFIG.Read_Width_B 16 \
  CONFIG.Register_PortB_Output_of_Memory_Core true \
  CONFIG.Register_PortB_Output_of_Memory_Primitives false \
  CONFIG.Use_Byte_Write_Enable false \
  CONFIG.Use_RSTB_Pin true \
  CONFIG.Write_Depth_A 32 \
  CONFIG.Write_Width_A 16 \
  CONFIG.Write_Width_B 16 \
  CONFIG.use_bram_block Stand_Alone \
] [get_bd_cells post_fft_rx09_ch02_blk_mem_gen]
create_bd_cell -type ip -vlnv xilinx.com:ip:blk_mem_gen:8.4 post_fft_rx09_ch03_blk_mem_gen
set_property -dict [list \
  CONFIG.Assume_Synchronous_Clk true \
  CONFIG.Enable_32bit_Address false \
  CONFIG.Enable_A Use_ENA_Pin \
  CONFIG.Enable_B Always_Enabled \
  CONFIG.Fill_Remaining_Memory_Locations false \
  CONFIG.Memory_Type Simple_Dual_Port_RAM \
  CONFIG.Operating_Mode_A NO_CHANGE \
  CONFIG.Port_B_Clock 100 \
  CONFIG.Port_B_Enable_Rate 100 \
  CONFIG.Read_Width_B 16 \
  CONFIG.Register_PortB_Output_of_Memory_Core true \
  CONFIG.Register_PortB_Output_of_Memory_Primitives false \
  CONFIG.Use_Byte_Write_Enable false \
  CONFIG.Use_RSTB_Pin true \
  CONFIG.Write_Depth_A 32 \
  CONFIG.Write_Width_A 16 \
  CONFIG.Write_Width_B 16 \
  CONFIG.use_bram_block Stand_Alone \
] [get_bd_cells post_fft_rx09_ch03_blk_mem_gen]
create_bd_cell -type ip -vlnv xilinx.com:ip:blk_mem_gen:8.4 post_fft_rx09_ch04_blk_mem_gen
set_property -dict [list \
  CONFIG.Assume_Synchronous_Clk true \
  CONFIG.Enable_32bit_Address false \
  CONFIG.Enable_A Use_ENA_Pin \
  CONFIG.Enable_B Always_Enabled \
  CONFIG.Fill_Remaining_Memory_Locations false \
  CONFIG.Memory_Type Simple_Dual_Port_RAM \
  CONFIG.Operating_Mode_A NO_CHANGE \
  CONFIG.Port_B_Clock 100 \
  CONFIG.Port_B_Enable_Rate 100 \
  CONFIG.Read_Width_B 16 \
  CONFIG.Register_PortB_Output_of_Memory_Core true \
  CONFIG.Register_PortB_Output_of_Memory_Primitives false \
  CONFIG.Use_Byte_Write_Enable false \
  CONFIG.Use_RSTB_Pin true \
  CONFIG.Write_Depth_A 32 \
  CONFIG.Write_Width_A 16 \
  CONFIG.Write_Width_B 16 \
  CONFIG.use_bram_block Stand_Alone \
] [get_bd_cells post_fft_rx09_ch04_blk_mem_gen]
create_bd_cell -type ip -vlnv xilinx.com:ip:blk_mem_gen:8.4 post_fft_rx09_ch05_blk_mem_gen
set_property -dict [list \
  CONFIG.Assume_Synchronous_Clk true \
  CONFIG.Enable_32bit_Address false \
  CONFIG.Enable_A Use_ENA_Pin \
  CONFIG.Enable_B Always_Enabled \
  CONFIG.Fill_Remaining_Memory_Locations false \
  CONFIG.Memory_Type Simple_Dual_Port_RAM \
  CONFIG.Operating_Mode_A NO_CHANGE \
  CONFIG.Port_B_Clock 100 \
  CONFIG.Port_B_Enable_Rate 100 \
  CONFIG.Read_Width_B 16 \
  CONFIG.Register_PortB_Output_of_Memory_Core true \
  CONFIG.Register_PortB_Output_of_Memory_Primitives false \
  CONFIG.Use_Byte_Write_Enable false \
  CONFIG.Use_RSTB_Pin true \
  CONFIG.Write_Depth_A 32 \
  CONFIG.Write_Width_A 16 \
  CONFIG.Write_Width_B 16 \
  CONFIG.use_bram_block Stand_Alone \
] [get_bd_cells post_fft_rx09_ch05_blk_mem_gen]
create_bd_cell -type ip -vlnv xilinx.com:ip:blk_mem_gen:8.4 post_fft_rx09_ch06_blk_mem_gen
set_property -dict [list \
  CONFIG.Assume_Synchronous_Clk true \
  CONFIG.Enable_32bit_Address false \
  CONFIG.Enable_A Use_ENA_Pin \
  CONFIG.Enable_B Always_Enabled \
  CONFIG.Fill_Remaining_Memory_Locations false \
  CONFIG.Memory_Type Simple_Dual_Port_RAM \
  CONFIG.Operating_Mode_A NO_CHANGE \
  CONFIG.Port_B_Clock 100 \
  CONFIG.Port_B_Enable_Rate 100 \
  CONFIG.Read_Width_B 16 \
  CONFIG.Register_PortB_Output_of_Memory_Core true \
  CONFIG.Register_PortB_Output_of_Memory_Primitives false \
  CONFIG.Use_Byte_Write_Enable false \
  CONFIG.Use_RSTB_Pin true \
  CONFIG.Write_Depth_A 32 \
  CONFIG.Write_Width_A 16 \
  CONFIG.Write_Width_B 16 \
  CONFIG.use_bram_block Stand_Alone \
] [get_bd_cells post_fft_rx09_ch06_blk_mem_gen]
create_bd_cell -type ip -vlnv xilinx.com:ip:blk_mem_gen:8.4 post_fft_rx09_ch07_blk_mem_gen
set_property -dict [list \
  CONFIG.Assume_Synchronous_Clk true \
  CONFIG.Enable_32bit_Address false \
  CONFIG.Enable_A Use_ENA_Pin \
  CONFIG.Enable_B Always_Enabled \
  CONFIG.Fill_Remaining_Memory_Locations false \
  CONFIG.Memory_Type Simple_Dual_Port_RAM \
  CONFIG.Operating_Mode_A NO_CHANGE \
  CONFIG.Port_B_Clock 100 \
  CONFIG.Port_B_Enable_Rate 100 \
  CONFIG.Read_Width_B 16 \
  CONFIG.Register_PortB_Output_of_Memory_Core true \
  CONFIG.Register_PortB_Output_of_Memory_Primitives false \
  CONFIG.Use_Byte_Write_Enable false \
  CONFIG.Use_RSTB_Pin true \
  CONFIG.Write_Depth_A 32 \
  CONFIG.Write_Width_A 16 \
  CONFIG.Write_Width_B 16 \
  CONFIG.use_bram_block Stand_Alone \
] [get_bd_cells post_fft_rx09_ch07_blk_mem_gen]
create_bd_cell -type module -reference TRX_post_fft_rx09_addr_decoder TRX_post_fft_rx09_decoder_0
create_bd_cell -type ip -vlnv xilinx.com:ip:xlconcat:2.1 post_fft_mem_a_rx09_xlconcat_0
set_property -dict {CONFIG.IN0_WIDTH 10 CONFIG.IN1_WIDTH 1 CONFIG.dout_width 11} [get_bd_cells post_fft_mem_a_rx09_xlconcat_0]

# ---- hierarchy /TRX_rx_FFT_unit/TRX_rx_FFT_calc ----
current_bd_instance /TRX_rx_FFT_unit/TRX_rx_FFT_calc
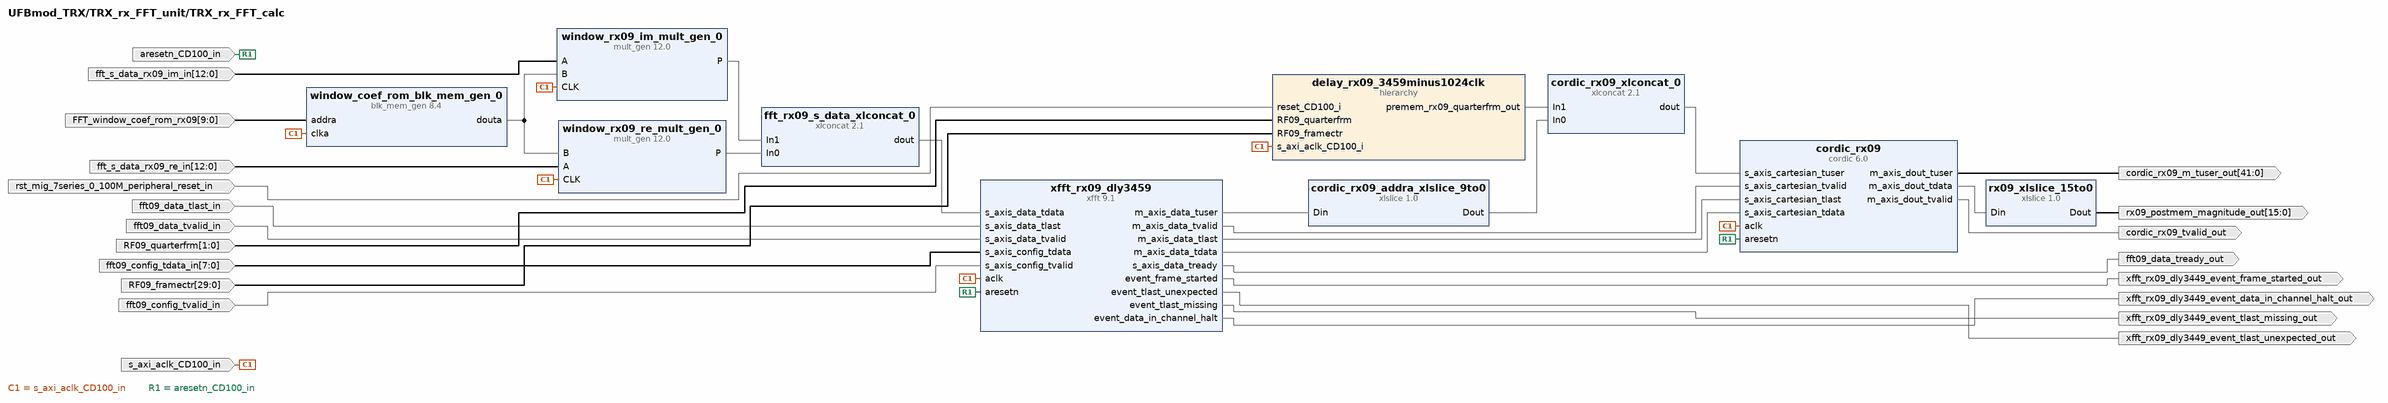
[diagram p10: block diagram inside /TRX_rx_FFT_unit/TRX_rx_FFT_calc]
create_bd_pin -dir I -type rst rst_mig_7series_0_100M_peripheral_reset_in
create_bd_pin -dir I -type clk s_axi_aclk_CD100_in
create_bd_pin -dir I fft09_data_tlast_in
create_bd_pin -dir O fft09_data_tready_out
create_bd_pin -dir I fft09_data_tvalid_in
create_bd_pin -dir I -from 7 -to 0 fft09_config_tdata_in
create_bd_pin -dir I fft09_config_tvalid_in
create_bd_pin -dir O -type intr xfft_rx09_dly3449_event_frame_started_out
create_bd_pin -dir O -type intr xfft_rx09_dly3449_event_tlast_unexpected_out
create_bd_pin -dir O -type intr xfft_rx09_dly3449_event_tlast_missing_out
create_bd_pin -dir O -type intr xfft_rx09_dly3449_event_data_in_channel_halt_out
create_bd_pin -dir O -from 15 -to 0 rx09_postmem_magnitude_out
create_bd_pin -dir O cordic_rx09_tvalid_out
create_bd_pin -dir I -from 12 -to 0 fft_s_data_rx09_re_in
create_bd_pin -dir I -from 12 -to 0 fft_s_data_rx09_im_in
create_bd_pin -dir I -from 1 -to 0 -type data RF09_quarterfrm
create_bd_pin -dir O -from 41 -to 0 cordic_rx09_m_tuser_out
create_bd_pin -dir I -from 29 -to 0 RF09_framectr
create_bd_pin -dir I -from 9 -to 0 FFT_window_coef_rom_rx09
create_bd_pin -dir I -type rst aresetn_CD100_in

create_bd_cell -type hier delay_rx09_3459minus1024clk
create_bd_cell -type ip -vlnv xilinx.com:ip:cordic:6.0 cordic_rx09
set_property -dict [list \
  CONFIG.ARESETN true \
  CONFIG.Coarse_Rotation true \
  CONFIG.Compensation_Scaling Embedded_Multiplier \
  CONFIG.Data_Format SignedFraction \
  CONFIG.Functional_Selection Translate \
  CONFIG.Input_Width 27 \
  CONFIG.Output_Width 16 \
  CONFIG.Round_Mode Nearest_Even \
  CONFIG.cartesian_has_tlast true \
  CONFIG.cartesian_has_tuser true \
  CONFIG.cartesian_tuser_width 42 \
  CONFIG.out_tlast_behv Pass_Cartesian_TLAST \
] [get_bd_cells cordic_rx09]
create_bd_cell -type ip -vlnv xilinx.com:ip:xlslice:1.0 rx09_xlslice_15to0
set_property -dict {CONFIG.DIN_FROM 15 CONFIG.DIN_TO 0 CONFIG.DIN_WIDTH 32 CONFIG.DOUT_WIDTH 16} [get_bd_cells rx09_xlslice_15to0]
create_bd_cell -type ip -vlnv xilinx.com:ip:xlslice:1.0 cordic_rx09_addra_xlslice_9to0
set_property -dict {CONFIG.DIN_FROM 9 CONFIG.DIN_WIDTH 16 CONFIG.DOUT_WIDTH 10} [get_bd_cells cordic_rx09_addra_xlslice_9to0]
create_bd_cell -type ip -vlnv xilinx.com:ip:mult_gen:12.0 window_rx09_re_mult_gen_0
set_property -dict [list \
  CONFIG.Multiplier_Construction Use_Mults \
  CONFIG.OutputWidthHigh 28 \
  CONFIG.OutputWidthLow 13 \
  CONFIG.PipeStages 3 \
  CONFIG.PortAType Signed \
  CONFIG.PortAWidth 13 \
  CONFIG.PortBType Unsigned \
  CONFIG.PortBWidth 16 \
  CONFIG.UseRounding true \
  CONFIG.Use_Custom_Output_Width true \
] [get_bd_cells window_rx09_re_mult_gen_0]
create_bd_cell -type ip -vlnv xilinx.com:ip:mult_gen:12.0 window_rx09_im_mult_gen_0
set_property -dict [list \
  CONFIG.Multiplier_Construction Use_Mults \
  CONFIG.OutputWidthHigh 28 \
  CONFIG.OutputWidthLow 13 \
  CONFIG.PipeStages 3 \
  CONFIG.PortAType Signed \
  CONFIG.PortAWidth 13 \
  CONFIG.PortBType Unsigned \
  CONFIG.PortBWidth 16 \
  CONFIG.UseRounding true \
  CONFIG.Use_Custom_Output_Width true \
] [get_bd_cells window_rx09_im_mult_gen_0]
create_bd_cell -type ip -vlnv xilinx.com:ip:blk_mem_gen:8.4 window_coef_rom_blk_mem_gen_0
set_property -dict [list \
  CONFIG.Coe_File ../../../../new/window_hann_1024_16bit_unsigned.coe \
  CONFIG.Enable_32bit_Address false \
  CONFIG.Enable_A Always_Enabled \
  CONFIG.Fill_Remaining_Memory_Locations false \
  CONFIG.Load_Init_File true \
  CONFIG.Memory_Type Single_Port_ROM \
  CONFIG.Port_A_Write_Rate 0 \
  CONFIG.Port_B_Clock 0 \
  CONFIG.Port_B_Enable_Rate 0 \
  CONFIG.Register_PortA_Output_of_Memory_Core true \
  CONFIG.Register_PortA_Output_of_Memory_Primitives true \
  CONFIG.Use_RSTA_Pin false \
  CONFIG.Write_Depth_A 1024 \
  CONFIG.Write_Width_A 16 \
  CONFIG.use_bram_block Stand_Alone \
] [get_bd_cells window_coef_rom_blk_mem_gen_0]
create_bd_cell -type ip -vlnv xilinx.com:ip:xlconcat:2.1 cordic_rx09_xlconcat_0
set_property -dict {CONFIG.IN0_WIDTH 10 CONFIG.IN1_WIDTH 32 CONFIG.dout_width 42} [get_bd_cells cordic_rx09_xlconcat_0]
create_bd_cell -type ip -vlnv xilinx.com:ip:xlconcat:2.1 fft_rx09_s_data_xlconcat_0
set_property -dict [list \
  CONFIG.IN0_WIDTH 16 \
  CONFIG.IN1_WIDTH 16 \
  CONFIG.IN2_WIDTH 13 \
  CONFIG.IN3_WIDTH 3 \
  CONFIG.IN4_WIDTH 13 \
  CONFIG.IN5_WIDTH 3 \
  CONFIG.IN6_WIDTH 13 \
  CONFIG.IN7_WIDTH 3 \
  CONFIG.NUM_PORTS 2 \
  CONFIG.dout_width 32 \
] [get_bd_cells fft_rx09_s_data_xlconcat_0]
create_bd_cell -type ip -vlnv xilinx.com:ip:xfft:9.1 xfft_rx09_dly3459
set_property -dict [list \
  CONFIG.aresetn true \
  CONFIG.butterfly_type use_xtremedsp_slices \
  CONFIG.channels 1 \
  CONFIG.complex_mult_type use_mults_performance \
  CONFIG.cyclic_prefix_insertion false \
  CONFIG.data_format fixed_point \
  CONFIG.implementation_options radix_4_burst_io \
  CONFIG.input_width 16 \
  CONFIG.memory_options_data block_ram \
  CONFIG.memory_options_hybrid true \
  CONFIG.memory_options_phase_factors block_ram \
  CONFIG.number_of_stages_using_block_ram_for_data_and_phase_factors 0 \
  CONFIG.output_ordering bit_reversed_order \
  CONFIG.rounding_modes convergent_rounding \
  CONFIG.scaling_options unscaled \
  CONFIG.target_clock_frequency 100 \
  CONFIG.target_data_throughput 50 \
  CONFIG.throttle_scheme realtime \
  CONFIG.transform_length 1024 \
  CONFIG.xk_index true \
] [get_bd_cells xfft_rx09_dly3459]

# ---- hierarchy /TRX_rx_FFT_unit/TRX_rx_FFT_calc/delay_rx09_3459minus1024clk ----
current_bd_instance /TRX_rx_FFT_unit/TRX_rx_FFT_calc/delay_rx09_3459minus1024clk
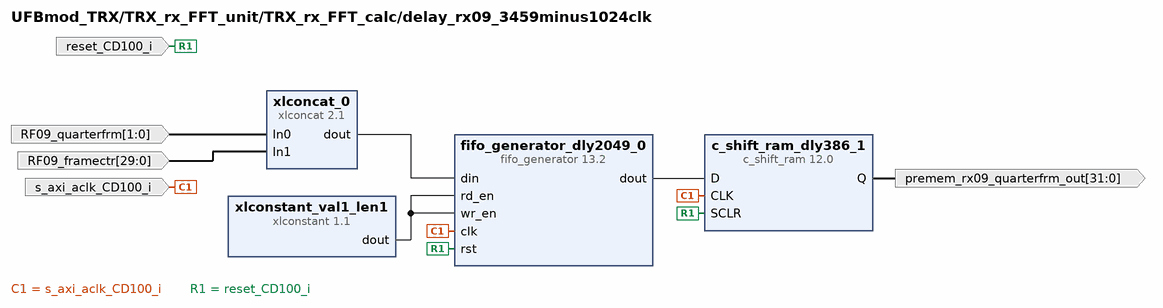
[diagram p11: block diagram inside /TRX_rx_FFT_unit/TRX_rx_FFT_calc/delay_rx09_3459minus1024clk]
create_bd_pin -dir I -type clk s_axi_aclk_CD100_i
create_bd_pin -dir I -type rst reset_CD100_i
create_bd_pin -dir O -from 31 -to 0 -type data premem_rx09_quarterfrm_out
create_bd_pin -dir I -from 1 -to 0 -type data RF09_quarterfrm
create_bd_pin -dir I -from 29 -to 0 RF09_framectr

create_bd_cell -type ip -vlnv xilinx.com:ip:c_shift_ram:12.0 c_shift_ram_dly386_1
set_property -dict [list \
  CONFIG.AsyncInitVal 00000000000000000000000000000000 \
  CONFIG.DefaultData 00000000000000000000000000000000 \
  CONFIG.Depth 386 \
  CONFIG.OptGoal Resources \
  CONFIG.SCLR true \
  CONFIG.ShiftRegType Fixed_Length \
  CONFIG.Width 32 \
] [get_bd_cells c_shift_ram_dly386_1]
create_bd_cell -type ip -vlnv xilinx.com:ip:fifo_generator:13.2 fifo_generator_dly2049_0
set_property -dict [list \
  CONFIG.Fifo_Implementation Common_Clock_Builtin_FIFO \
  CONFIG.Input_Data_Width 32 \
  CONFIG.Input_Depth 2048 \
] [get_bd_cells fifo_generator_dly2049_0]
create_bd_cell -type ip -vlnv xilinx.com:ip:xlconstant:1.1 xlconstant_val1_len1
create_bd_cell -type ip -vlnv xilinx.com:ip:xlconcat:2.1 xlconcat_0
set_property -dict {CONFIG.IN0_WIDTH 2 CONFIG.IN1_WIDTH 30 CONFIG.dout_width 32} [get_bd_cells xlconcat_0]
